# Altium project Mako DSP.PrjPCB (part 1 of 2)
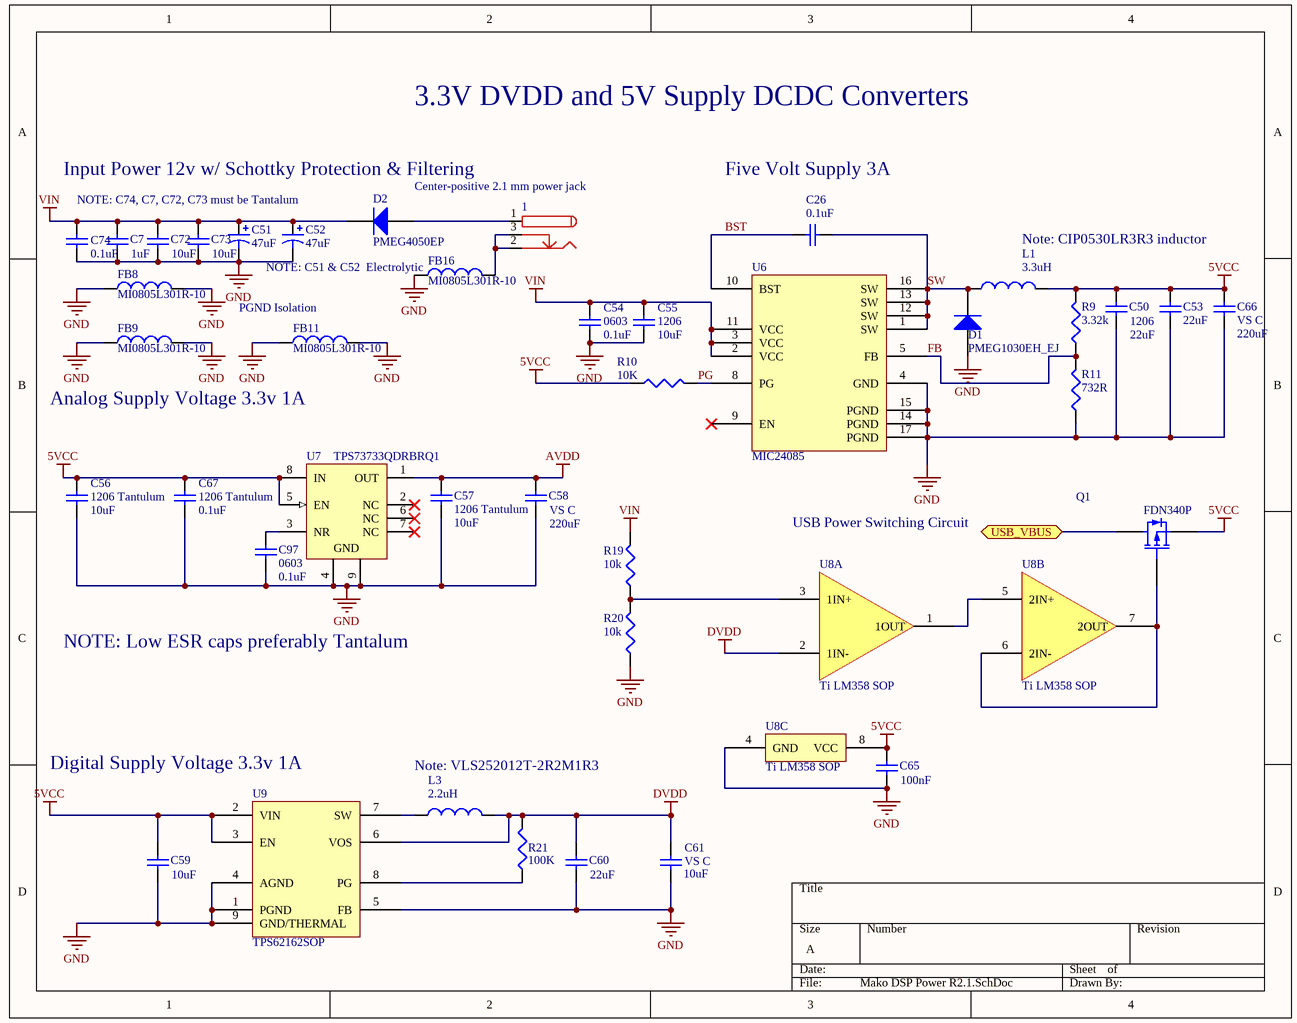
[diagram p0: Mako DSP Power R2.1.SchDoc]
8 sheets, 224 parts. Net scope: flat (ports and power ports of the same name join across sheets).
Board file: Mako DSP R2.0.PcbDoc
Sheets:
  Mako DSP Power R2.1.SchDoc
  Mako DSP Audio Codec R2.1.SchDoc
  Mako DSP Main R2.1.SchDoc
  Mako DSP Arduio IO R2.1.SchDoc
  Mako DSP USB R2.1.SchDoc
  Mako DSP Memory R2.1.SchDoc
  Mako DSP QuadFlash and Boot R2.1.SchDoc
  Mako DSP SD Card and MIDI R2.1.SchDoc

## Sheet Mako DSP Power R2.1.SchDoc
size A

### Parts
1  Center-positive 2.1 mm power jack  [PJ-102AH]
C7  value 1uF  [C1206]  (hidden comment: Cap Semi)
C26  value 0.1uF  [1608[0603]]  (hidden comment: Cap Semi)
C50  1206  value 22uF  [C1206]
C51  value 47uF  [CAPPR2.5-6.3x5]  (hidden comment: Cap Pol1)
C52  value 47uF  [CAPPR2.5-6.3x5]  (hidden comment: Cap Pol1)
C53  value 22uF  [C1206]  (hidden comment: Cap Semi)
C54  0603  value 0.1uF  [1608[0603]]
C55  1206  value 10uF  [C1206]
C56  1206 Tantulum  value 10uF  [C1206]
C57  1206 Tantulum  value 10uF  [C1206]
C58  VS C  value 220uF  [Panasonic VS C]
C59  value 10uF  [C1206]  (hidden comment: Cap Semi)
C60  value 22uF  [C1206]  (hidden comment: Cap Semi)
C61  VS C  value 10uF  [Panasonic VS C]
C65  value 100nF  [1608[0603]]  (hidden comment: Cap Semi)
C66  VS C  value 220uF  [Panasonic VS C]
C67  1206 Tantulum  value 0.1uF  [C1206]
C72  value 10uF  [C1206]  (hidden comment: Cap Semi)
C73  value 10uF  [C1206]  (hidden comment: Cap Semi)
C74  value 0.1uF  [C1206]  (hidden comment: Cap Semi)
C97  0603  value 0.1uF  [1608[0603]]
D1  PMEG1030EH_EJ  [PMEG1030EH_EJ]
D2  PMEG4050EP  [PMEG4050EP]
FB8  MI0805L301R-10  [SM 0805 - gap trimmed]
FB9  MI0805L301R-10  [SM 0805 - gap trimmed]
FB11  MI0805L301R-10  [SM 0805 - gap trimmed]
FB16  MI0805L301R-10  [SM 0805 - gap trimmed]
L1  value 3.3uH  [CIP0530LR3R3]  (hidden comment: Inductor)
L3  value 2.2uH  [VLS252012T-2R2M1R3]  (hidden comment: Inductor)
Q1  FDN340P  [SOT23-3N]
R9  value 3.32k  [J1-0603]  (hidden comment: Res3)
R10  value 10K  [J1-0603]  (hidden comment: Res3)
R11  value 732R  [J1-0603]  (hidden comment: Res3)
R19  value 10k  [J1-0603]  (hidden comment: Res3)
R20  value 10k  [J1-0603]  (hidden comment: Res3)
R21  value 100K  [RESC2012L]  (hidden comment: Res3)
U6  MIC24085  [MIC24085-AYML]
U7  TPS73733QDRBRQ1  [TI-DRB8-1750X1500TP_V]
U8  Ti LM358 SOP  [LM358]  (parts A,B,C of 3)
U9  TPS62162SOP  [TPS62162SOP]

### Ports
USB_VBUS (bidir)

### Nets
5VCC: C50.2 C53.1 C56.1 C59.2 C65.1 C66.2 C67.2 L1.2 Q1.2(D) R9.2 R10.1 U7.5(EN) U7.8(IN) U8.8(VCC) U9.2(VIN) U9.3(EN)
AVDD: C57.1 C58.1 U7.1(OUT)
DVDD: C60.2 C61.1 L3.2 R21.2 U8.2(1IN-) U9.6(VOS)
GND: C7.1 C50.1 C51.2 C52.2 C53.2 C54.1 C55.1 C56.2 C57.2 C58.2 C59.1 C60.1 C61.2 C65.2 C66.1 C67.1 C72.1 C73.1 C74.1 C97.1 D1.1(A) FB8.1 FB8.2 FB9.1 FB9.2 FB11.1 FB11.2 FB16.1 R11.1 R20.1 U6.4(GND) U6.14(PGND) U6.15(PGND) U6.17(PGND) U7.4(GND) U7.9(GND) U8.4(GND) U9.1(PGND) U9.4(AGND) U9.5(FB) U9.9(GND/THERMAL)
VIN: C7.2 C51.1 C52.1 C54.2 C55.2 C72.2 C73.2 C74.2 D2.1(A) R19.2 U6.2(VCC) U6.3(VCC) U6.11(VCC)
BST: C26.2 U6.10(BST)
FB: R9.1 R11.2 U6.5(FB)
PG: R10.2 U6.8(PG)
SW: C26.1 D1.2(K) L1.1 U6.1(SW) U6.12(SW) U6.13(SW) U6.16(SW)
Net1_1: 1.1 D2.2(K)
Net1_2: 1.2 1.3 FB16.2
NetC97_2: C97.2 U7.3(NR)
NetL3_1: L3.1 U9.7(SW)
NetQ1_1: Q1.1(G) U8.6(2IN-) U8.7(2OUT)
NetQ1_3: Q1.3(S) ; port USB_VBUS
NetR19_1: R19.1 R20.2 U8.3(1IN+)
NetR21_1: R21.1 U9.8(PG)
NetU8_1: U8.1(1OUT) U8.5(2IN+)

Not connected (* = marked no-connect by the designer): U6 6(NC) 7(NC) 9(EN)*; U7 2(NC)* 6(NC)* 7(NC)*

### Notes on the sheet
- 3.3V DVDD and 5V Supply DCDC Converters
- Input Power 12v w/ Schottky Protection & Filtering
- NOTE: C74, C7, C72, C73 must be Tantalum
- Five Volt Supply 3A
- (near FB16) NOTE: C51 & C52  Electrolytic
- Note: CIP0530LR3R3 inductor
- (near FB11) PGND Isolation
- Analog Supply Voltage 3.3v 1A
- USB Power Switching Circuit
- NOTE: Low ESR caps preferably Tantalum
- (near U9) Digital Supply Voltage 3.3v 1A
- Note: VLS252012T-2R2M1R3

### Library data of the parts
1 = PWR2.5: Power jack; Published: 17-Dec-2003; DatasheetDocument: 09-May-2002; Publisher: Altium Limited; ComponentLink1Description: Manufacturer Link; ComponentLink1URL: http://domino.kycon.com/internet/Products.html
C7 C26 C50 C53-C61 C65-C67 C72-C74 C97 = Cap Semi: Capacitor (Semiconductor SIM Model); Published: 8-Jun-2000; LatestRevisionDate: 29-May-2009; LatestRevisionNote: IPC-7351 Footprint Added.; PackageReference: C1206; Publisher: Altium Limited; PackageDescription: Chip Capacitor
C51 C52 = Cap Pol1: Polarized Capacitor (Radial); Published: 8-Jun-2000; LatestRevisionDate: 17-Jul-2002; LatestRevisionNote: Re-released for DXP Platform.; PackageReference: RB7.6-15; Publisher: Altium Limited; PackageDescription: Polarized Capacitor (Radial); 2 Leads
D1 D2 = Diode: Default Diode; Published: 8-Jun-2000; LatestRevisionDate: 17-Jul-2002; LatestRevisionNote: Re-released for DXP Platform.; PackageVersion: Sep-1996; PackageReference: SMC; Publisher: Altium Limited; PackageDescription: DO-214-AB/SMC; 2 C-Bend Leads; Body 7.9 x 5.9 mm, inc. leads (LxW); Code_JEDEC: DO-214-AB
FB8 FB9 FB11 FB16 L1 L3 = Inductor: Code_IEC: 1005; Published: 8-Jun-2000; PackageReference: 0402-A; Publisher: Altium Limited; Code_JEITA: 0402
  FB8 FB9 FB11 FB16: LatestRevisionDate: 17-Jul-2002; LatestRevisionNote: Re-released for DXP Platform.
  L1 L3: LatestRevisionDate: 29-May-2009; LatestRevisionNote: IPC-7351 Footprint Added.; PackageDescription: Chip Inductor
Q1 = FDN340P: P-Channel MOSFET; Published: 8-Jun-2000; LatestRevisionDate: 17-Jul-2002; LatestRevisionNote: Re-released for DXP Platform.; PackageVersion: 1995/1996; PackageReference: E3; Publisher: Altium Limited; PackageDescription: TO, Flat Index; 3 In-Line, Axial Leads; Body Dia. 4.6mm; Lead Dia. 0.5 mm (max)
R9-R11 R19-R21 = Res3: Resistor; Published: 8-Jun-2000; LatestRevisionDate: 29-May-2009; LatestRevisionNote: IPC-7351 Footprint Added.; PackageReference: J1-0603; Publisher: Altium Limited; PackageDescription: Chip Resistor
U7 = TPS73733QDRBRQ1: Single Output Automotive LDO, 1 A, Fixed 3.3 V Output, 2.2 to 5.5 V Input, with Reverse Current Protection, 8-pin SON (DRB), -40 to 125 degC, Green (RoHS & no Sb/Br); Manufacturer: Texas Instruments; Accuracy(%): 3; Fixed Output Options(V): 3.3; Iout(Max)(A): 1; Iq(Typ)(mA): 0.3; SubFamily: Single Channel LDO; Vdo(Typ)(mV): 130; Vin(Max)(V): 5.5; Vin(Min)(V): 2.2; DatasheetVersion: SBVS123; PackageVersion: 4203482-2/K; PackageReference: DRB8-1750X1500TP; PackageDescription: 8-Pin Plastic Small Outline, Body 3 x 3 mm, Pitch 0.65 mm; Supplier 1: Digi-Key; Supplier Part Number 1: 296-24157-2-ND; Supplier 2: Digi-Key; Supplier Part Number 2: 296-24157-1-ND; Supplier 3: Digi-Key; Supplier Part Number 3: 296-24157-6-ND; Supplier 4: Newark; Supplier Part Number 4: 56P3118; Supplier 5: Mouser; Supplier Part Number 5: 595-TPS73733QDRBRQ1; Eco-Plan: Green (RoHS & no Sb/Br); Rating: Automotive; Vout Adj(Max)(V): 3.3; Vout Adj(Min)(V): 3.3; Mounting Technology: Surface Mount; PartNumber: TPS73733QDRBRQ1; ComponentLink1Description: Manufacturer URL; ComponentLink1URL: http://www.ti.com/; ComponentLink2Description: Datasheet; ComponentLink2URL: http://www.ti.com/general/docs/lit/getliterature.tsp?genericPartNumber=TPS73733-Q1&fileType=pdf; ComponentLink3Description: Package Specification; ComponentLink3URL: http://www.ti.com/litv/pdf/mpds118h
U8 = LM358_Symbol

## Sheet Mako DSP Audio Codec R2.1.SchDoc
size B
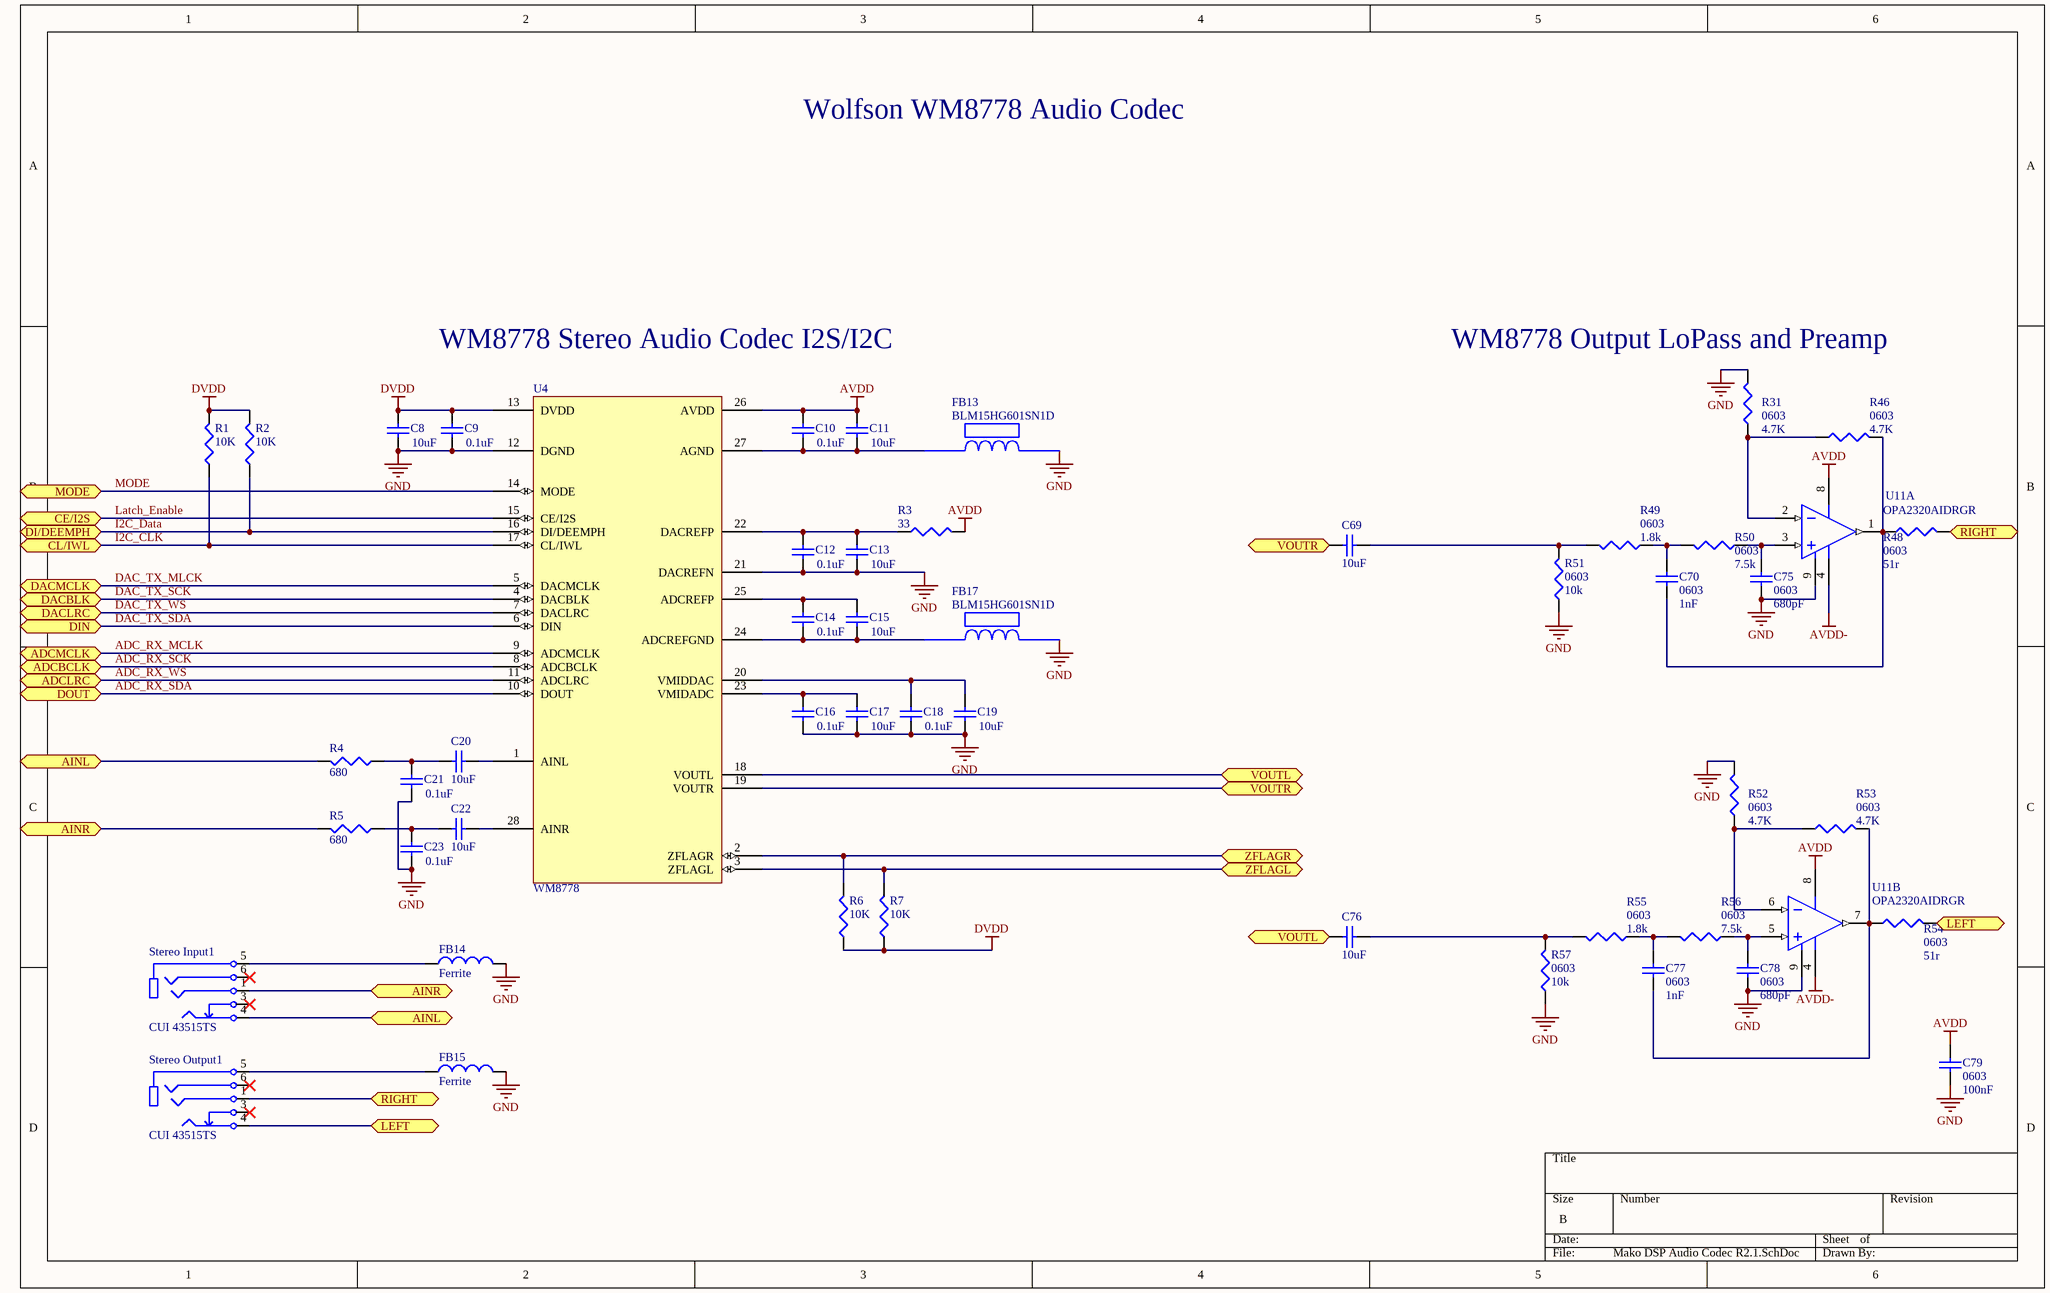
[diagram p1: Mako DSP Audio Codec R2.1.SchDoc]

### Parts
C8  value 10uF  [1608[0603]]  (hidden comment: Cap Semi)
C9  value 0.1uF  [1608[0603]]  (hidden comment: Cap Semi)
C10  value 0.1uF  [1608[0603]]  (hidden comment: Cap Semi)
C11  value 10uF  [1608[0603]]  (hidden comment: Cap Semi)
C12  value 0.1uF  [1608[0603]]  (hidden comment: Cap Semi)
C13  value 10uF  [1608[0603]]  (hidden comment: Cap Semi)
C14  value 0.1uF  [1608[0603]]  (hidden comment: Cap Semi)
C15  value 10uF  [1608[0603]]  (hidden comment: Cap Semi)
C16  value 0.1uF  [1608[0603]]  (hidden comment: Cap Semi)
C17  value 10uF  [1608[0603]]  (hidden comment: Cap Semi)
C18  value 0.1uF  [1608[0603]]  (hidden comment: Cap Semi)
C19  value 10uF  [1608[0603]]  (hidden comment: Cap Semi)
C20  value 10uF  [Panasonic VS B]  (hidden comment: Cap Semi)
C21  value 0.1uF  [SM 0805 - gap trimmed]  (hidden comment: Cap Semi)
C22  value 10uF  [Panasonic VS B]  (hidden comment: Cap Semi)
C23  value 0.1uF  [SM 0805 - gap trimmed]  (hidden comment: Cap Semi)
C69  value 10uF  [Panasonic VS B]  (hidden comment: Cap Semi)
C70  0603  value 1nF  [1608[0603]]
C75  0603  value 680pF  [1608[0603]]
C76  value 10uF  [Panasonic VS B]  (hidden comment: Cap Semi)
C77  0603  value 1nF  [1608[0603]]
C78  0603  value 680pF  [1608[0603]]
C79  0603  value 100nF  [1608[0603]]
FB13  BLM15HG601SN1D  [BLM18PG121SN1D]
FB14  Ferrite  [SM 0805 - gap trimmed]
FB15  Ferrite  [SM 0805 - gap trimmed]
FB17  BLM15HG601SN1D  [BLM18PG121SN1D]
R1  value 10K  [J1-0603]  (hidden comment: Res3)
R2  value 10K  [J1-0603]  (hidden comment: Res3)
R3  value 33  [J1-0603]  (hidden comment: Res3)
R4  value 680  [SM 0805 - gap trimmed]  (hidden comment: Res3)
R5  value 680  [SM 0805 - gap trimmed]  (hidden comment: Res3)
R6  value 10K  [J1-0603]  (hidden comment: Res3)
R7  value 10K  [J1-0603]  (hidden comment: Res3)
R31  0603  value 4.7K  [J1-0603]
R46  0603  value 4.7K  [J1-0603]
R48  0603  value 51r  [J1-0603]
R49  0603  value 1.8k  [J1-0603]
R50  0603  value 7.5k  [J1-0603]
R51  0603  value 10k  [J1-0603]
R52  0603  value 4.7K  [J1-0603]
R53  0603  value 4.7K  [J1-0603]
R54  0603  value 51r  [J1-0603]
R55  0603  value 1.8k  [J1-0603]
R56  0603  value 7.5k  [J1-0603]
R57  0603  value 10k  [J1-0603]
Stereo_Input1  CUI 43515TS  [CUI SJ-43515TS]
Stereo_Output1  CUI 43515TS  [CUI SJ-43515TS]
U4  WM8778  [WM8778]
U11  OPA2320AIDRGR  [TI-DRG8-2000X1200TP_V]  (parts A,B of 2)

### Ports
ADCBCLK (bidir), ADCLRC (bidir), ADCMCLK (bidir), AINL, AINR, CE/I2S (bidir), CL/IWL (bidir), DACBLK (bidir), DACLRC (bidir), DACMCLK (bidir), DI/DEEMPH (bidir), DIN (bidir), DOUT (bidir), LEFT, MODE (bidir), RIGHT, VOUTL, VOUTR, ZFLAGL (bidir), ZFLAGR (bidir)

### Nets
AVDD: C10.2 C11.2 C79.2 R3.2 U4.26(AVDD) U11.8(V+)
AVDD-: U11.4(V-)
DVDD: C8.2 C9.2 R1.2 R2.2 R6.1 R7.1 U4.13(DVDD)
GND: C8.1 C9.1 C12.1 C13.1 C16.1 C17.1 C18.1 C19.1 C21.1 C23.1 C75.1 C78.1 C79.1 FB13.2 FB14.2 FB15.2 FB17.2 R31.2 R51.1 R52.2 R57.1 U4.12(DGND) U4.21(DACREFN) U11.9(EP)
ADC_RX_MCLK: U4.9(ADCMCLK) ; port ADCMCLK
ADC_RX_SCK: U4.8(ADCBCLK) ; port ADCBCLK
ADC_RX_SDA: U4.10(DOUT) ; port DOUT
ADC_RX_WS: U4.11(ADCLRC) ; port ADCLRC
DAC_TX_MLCK: U4.5(DACMCLK) ; port DACMCLK
DAC_TX_SCK: U4.4(DACBLK) ; port DACBLK
DAC_TX_SDA: U4.6(DIN) ; port DIN
DAC_TX_WS: U4.7(DACLRC) ; port DACLRC
I2C_CLK: R1.1 U4.17(CL/IWL) ; port CL/IWL
I2C_Data: R2.1 U4.16(DI/DEEMPH) ; port DI/DEEMPH
Latch_Enable: U4.15(CE/I2S) ; port CE/I2S
MODE: U4.14(MODE) ; port MODE
NetC10_1: C10.1 C11.1 FB13.1 U4.27(AGND)
NetC12_2: C12.2 C13.2 R3.1 U4.22(DACREFP)
NetC14_1: C14.1 C15.1 FB17.1 U4.24(ADCREFGND)
NetC14_2: C14.2 C15.2 U4.25(ADCREFP)
NetC16_2: C16.2 C17.2 U4.23(VMIDADC)
NetC18_2: C18.2 C19.2 U4.20(VMIDDAC)
NetC20_1: C20.1 U4.1(AINL)
NetC20_2: C20.2 C21.2 R4.1
NetC22_1: C22.1 U4.28(AINR)
NetC22_2: C22.2 C23.2 R5.1
NetC69_1: C69.1 U4.19(VOUTR) ; port VOUTR
NetC69_2: C69.2 R49.2 R51.2
NetC70_1: C70.1 R46.2 R48.1 U11.1(OUT_A)
NetC70_2: C70.2 R49.1 R50.2
NetC75_2: C75.2 R50.1 U11.3(IN_A+)
NetC76_1: C76.1 U4.18(VOUTL) ; port VOUTL
NetC76_2: C76.2 R55.2 R57.2
NetC77_1: C77.1 R53.2 R54.1 U11.7(OUT_B)
NetC77_2: C77.2 R55.1 R56.2
NetC78_2: C78.2 R56.1 U11.5(IN_B+)
NetFB14_1: FB14.1 Stereo_Input1.5(SLEEVE)
NetFB15_1: FB15.1 Stereo_Output1.5(SLEEVE)
NetR4_2: R4.2 Stereo_Input1.4(TIP) ; port AINL
NetR5_2: R5.2 Stereo_Input1.1(R1) ; port AINR
NetR6_2: R6.2 U4.2(ZFLAGR) ; port ZFLAGR
NetR7_2: R7.2 U4.3(ZFLAGL) ; port ZFLAGL
NetR31_1: R31.1 R46.1 U11.2(IN_A-)
NetR48_2: R48.2 Stereo_Output1.1(R1) ; port RIGHT
NetR52_1: R52.1 R53.1 U11.6(IN_B-)
NetR54_2: R54.2 Stereo_Output1.4(TIP) ; port LEFT

Not connected (* = marked no-connect by the designer): Stereo_Input1 3(TS)* 6(R2)*; Stereo_Output1 3(TS)* 6(R2)*

### Notes on the sheet
- Wolfson WM8778 Audio Codec
- WM8778 Stereo Audio Codec I2S/I2C
- (near R31) WM8778 Output LoPass and Preamp

### Library data of the parts
C8-C23 C69 C70 C75-C79 = Cap Semi: Capacitor (Semiconductor SIM Model); Published: 8-Jun-2000; LatestRevisionDate: 29-May-2009; LatestRevisionNote: IPC-7351 Footprint Added.; PackageReference: C1206; Publisher: Altium Limited; PackageDescription: Chip Capacitor
FB14 FB15 = Inductor: Code_IEC: 1005; Published: 8-Jun-2000; LatestRevisionDate: 17-Jul-2002; LatestRevisionNote: Re-released for DXP Platform.; PackageReference: 0402-A; Publisher: Altium Limited; Code_JEITA: 0402
R1-R7 R31 R46 R48-R57 = Res3: Resistor; Published: 8-Jun-2000; LatestRevisionDate: 29-May-2009; LatestRevisionNote: IPC-7351 Footprint Added.; PackageReference: J1-0603; Publisher: Altium Limited; PackageDescription: Chip Resistor
U11 = OPA2320AIDRGR: Precision, 20 MHz, 0.9 pA Ib, RRIO, CMOS Operational Amplifier, 1.8 to 5.5 V, -40 to 125 degC, 8-pin SON (DRG8), Green (RoHS & no Sb/Br); Manufacturer: Texas Instruments; CMRR(Min)(dB): 100; IIB(Max)(pA): 400; Iq per channel(Max)(mA): 1.6; Number of Channels: 2; Offset Drift(Typ)(uV/C): 1.5; Slew Rate(Typ)(V/us): 10; Sub Family: High Output Current Amplifier (>=50mA), Low Input Bias Current Amp (<=10pA), Low Noise Amp (<=10nV/rtHz), Low Offset Voltage Amplifier (<=500uV), Low Supply Voltage Amplifier (<=2.7V), Precision Amplifier; Total Supply Voltage(Max)(+5V is 5, +/-5V is 10): 5.5; Total Supply Voltage(Min)(+5V is 5, +/-5V is 10): 1.8; Vio (25C)(Max)(mV): 0.15; Vn at 1kHz(Typ)(nV/rtHz): 8.5; DatasheetVersion: SBOS513D; PackageVersion: 4205379/C, 12/2010; PackageReference: DRG8-2000X1200TP; PackageDescription: 8-Pin Plastic Small Outline, Body 3 x 3 mm, Pitch 0.5 mm; Supplier 1: Digi-Key; Supplier Part Number 1: OPA2320AIDRGR-ND; Supplier 2: Mouser; Supplier Part Number 2: 595-OPA2320AIDRGR; Eco-Plan: Green (RoHS & no Sb/Br); Mounting Technology: Surface Mount; Code_JEDEC: MO-229; PartNumber: OPA2320AIDRGR; ComponentLink1Description: Manufacturer URL; ComponentLink1URL: http://www.ti.com/; ComponentLink2Description: Datasheet; ComponentLink2URL: http://www.ti.com/general/docs/lit/getliterature.tsp?genericPartNumber=OPA2320&fileType=pdf; ComponentLink3Description: Package Specification; ComponentLink3URL: http://www.ti.com/litv/pdf/mpds151b

## Sheet Mako DSP Main R2.1.SchDoc
size C
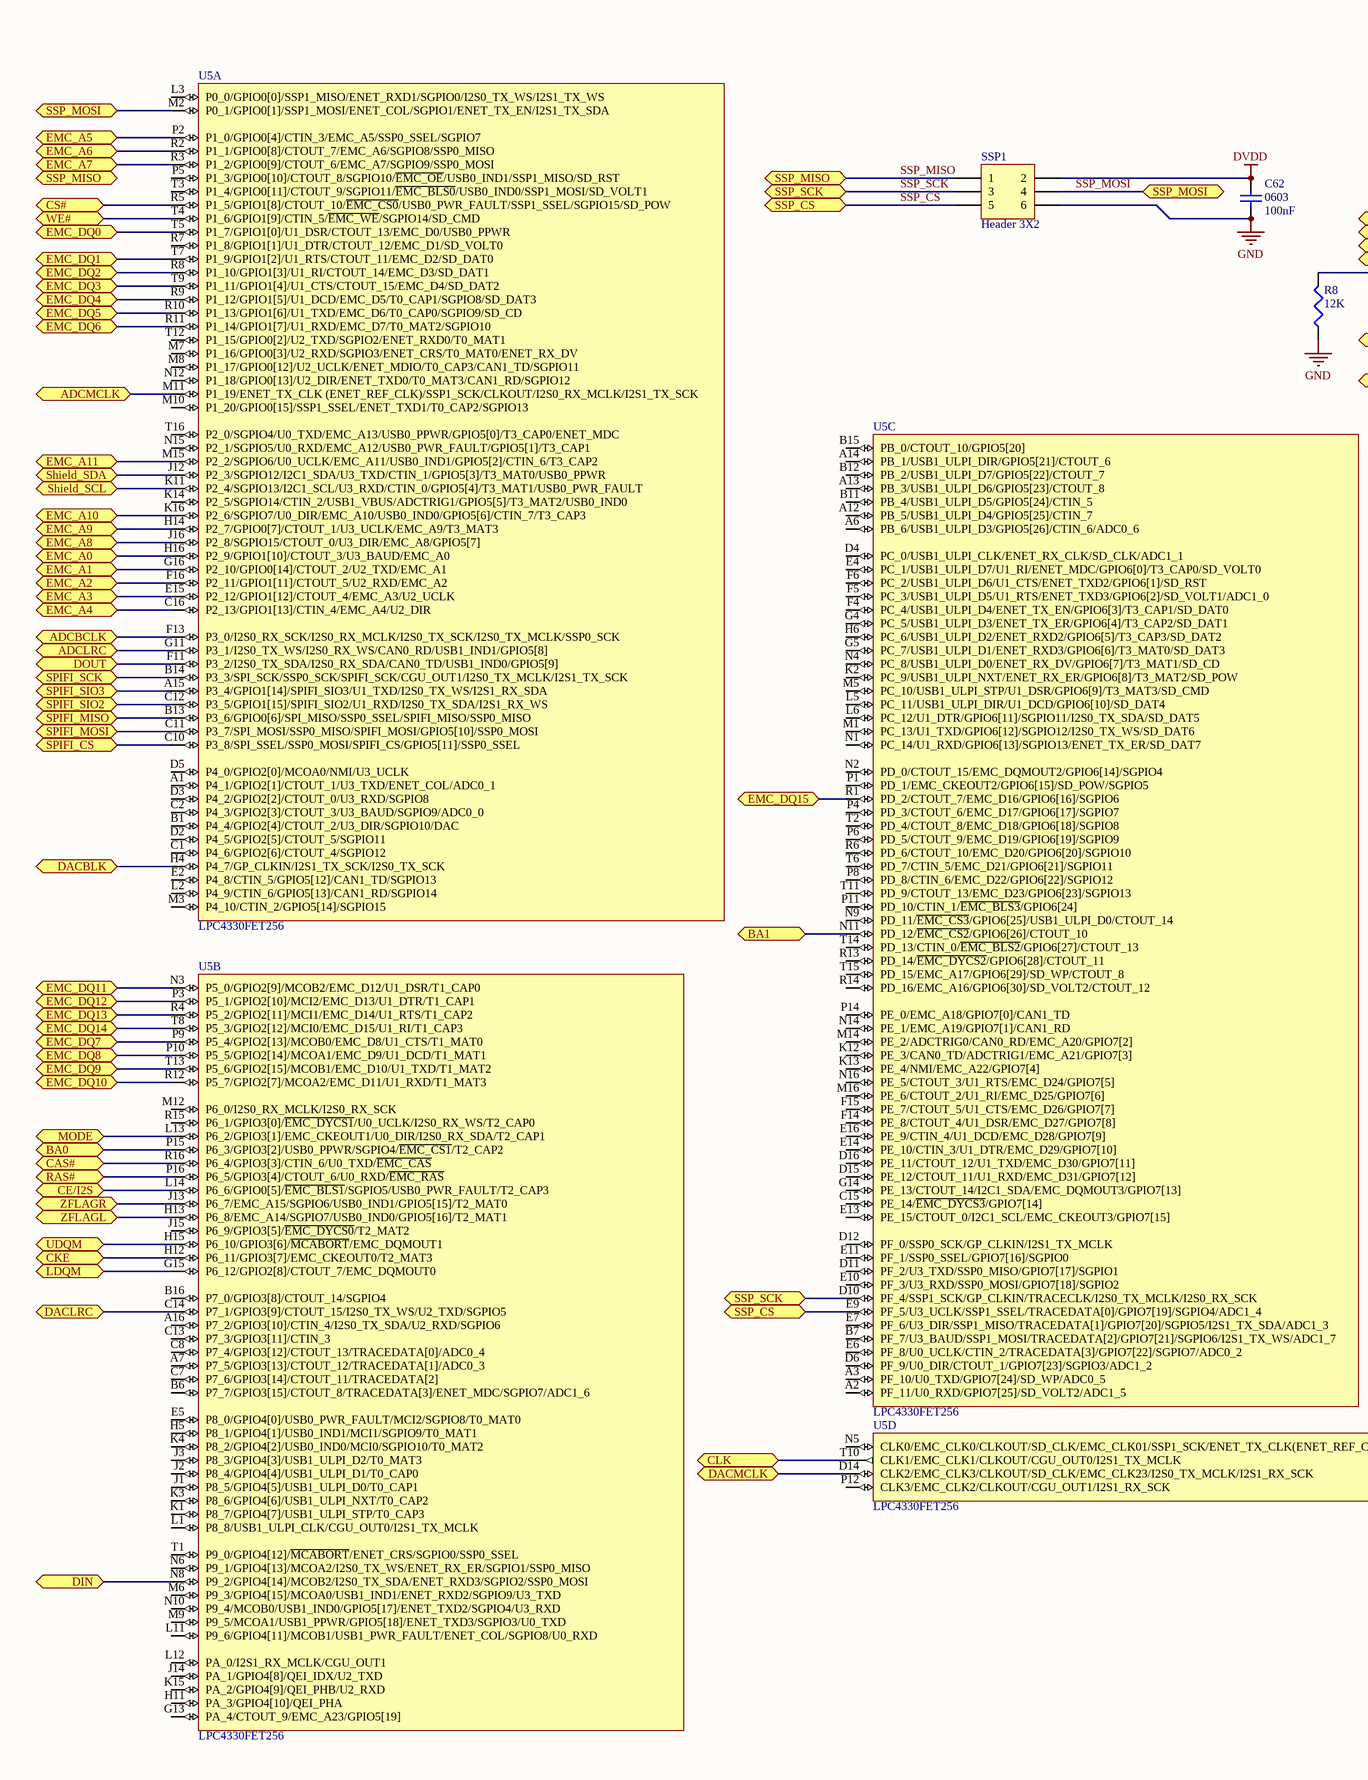
[diagram p2: Mako DSP Main R2.1.SchDoc, left]
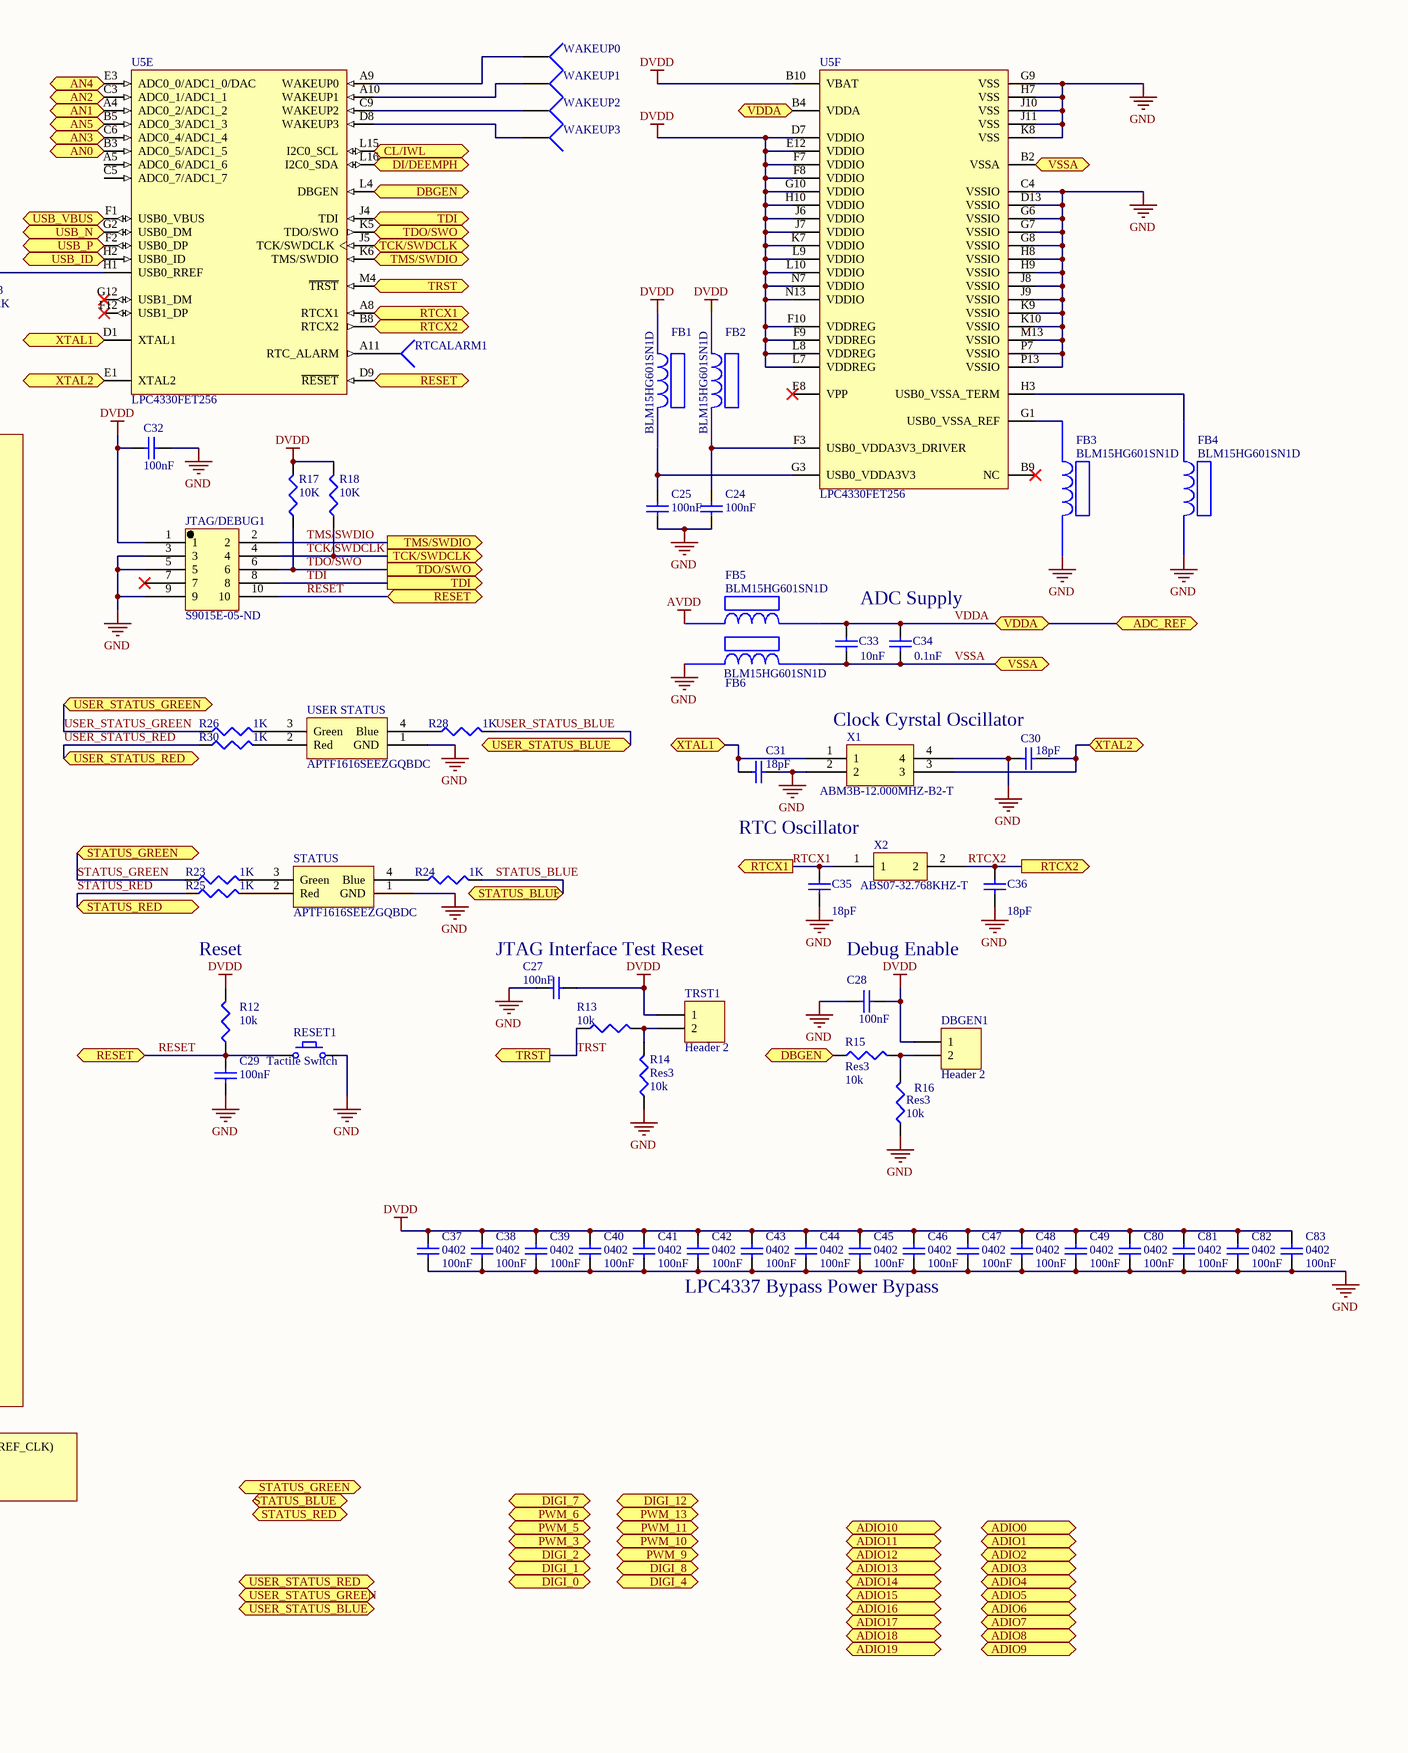
[diagram p3: Mako DSP Main R2.1.SchDoc, right]

### Parts
C24  value 100nF  [0402]  (hidden comment: Cap Semi)
C25  value 100nF  [0402]  (hidden comment: Cap Semi)
C27  C1: 100nF  [CAPC1608L]  (hidden comment: Cap Semi)
C28  C1: 100nF  [CAPC1608L]  (hidden comment: Cap Semi)
C29  C1: 100nF  [CAPC1608L]  (hidden comment: Cap Semi)
C30  value 18pF  [1608[0603]]  (hidden comment: Cap Semi)
C31  value 18pF  [1608[0603]]  (hidden comment: Cap Semi)
C32  C1: 100nF  [CAPC1608L]  (hidden comment: Cap Semi)
C33  value 10nF  [1608[0603]]  (hidden comment: Cap Semi)
C34  value 0.1nF  [1608[0603]]  (hidden comment: Cap Semi)
C35  value 18pF  [1608[0603]]  (hidden comment: Cap Semi)
C36  value 18pF  [1608[0603]]  (hidden comment: Cap Semi)
C37  0402  value 100nF  [0402]
C38  0402  value 100nF  [0402]
C39  0402  value 100nF  [0402]
C40  0402  value 100nF  [0402]
C41  0402  value 100nF  [0402]
C42  0402  value 100nF  [0402]
C43  0402  value 100nF  [0402]
C44  0402  value 100nF  [0402]
C45  0402  value 100nF  [0402]
C46  0402  value 100nF  [0402]
C47  0402  value 100nF  [0402]
C48  0402  value 100nF  [0402]
C49  0402  value 100nF  [0402]
C62  0603  value 100nF  [1608[0603]]
C80  0402  value 100nF  [0402]
C81  0402  value 100nF  [0402]
C82  0402  value 100nF  [0402]
C83  0402  value 100nF  [0402]
DBGEN1  Header 2  [HDR1X2]
FB1  BLM15HG601SN1D  [BLM18PG121SN1D]
FB2  BLM15HG601SN1D  [BLM18PG121SN1D]
FB3  BLM15HG601SN1D  [BLM18PG121SN1D]
FB4  BLM15HG601SN1D  [BLM18PG121SN1D]
FB5  BLM15HG601SN1D  [BLM18PG121SN1D]
FB6  BLM15HG601SN1D  [BLM18PG121SN1D]
JTAG/DEBUG1  S9015E-05-ND  [S9015E-05-ND]
R8  value 12K  [J1-0603]  (hidden comment: Res3)
R12  value 10k  [J1-0603]  (hidden comment: Res3)
R13  value 10k  [J1-0603]  (hidden comment: Res3)
R14  Res3  value 10k  [J1-0603]
R15  Res3  value 10k  [J1-0603]
R16  Res3  value 10k  [J1-0603]
R17  value 10K  [J1-0603]  (hidden comment: Res3)
R18  value 10K  [J1-0603]  (hidden comment: Res3)
R23  value 1K  [J1-0603]  (hidden comment: Res3)
R24  value 1K  [J1-0603]  (hidden comment: Res3)
R25  value 1K  [J1-0603]  (hidden comment: Res3)
R26  value 1K  [J1-0603]  (hidden comment: Res3)
R28  value 1K  [J1-0603]  (hidden comment: Res3)
R30  value 1K  [J1-0603]  (hidden comment: Res3)
RESET1  Tactile Switch  [TL3301]
RTCALARM1  Socket  [PIN1]  (value not drawn)
SSP1  Header 3X2  [HDR2X3]
STATUS  APTF1616SEEZGQBDC  [RGB LED APTF1616SEEZGQBDC]
TRST1  Header 2  [HDR1X2]
U5  LPC4330FET256  [SOT740-2]  (parts A,B,C,D,E,F of 6)
USER_STATUS  APTF1616SEEZGQBDC  [RGB LED APTF1616SEEZGQBDC]
WAKEUP0  Socket  [PIN1]  (value not drawn)
WAKEUP1  Socket  [PIN1]  (value not drawn)
WAKEUP2  Socket  [PIN1]  (value not drawn)
WAKEUP3  Socket  [PIN1]  (value not drawn)
X1  ABM3B-12.000MHZ-B2-T  [ABM3B-12.000MHZ-B2-T]
X2  ABS07-32.768KHZ-T  [ABS07-32.768KHZ-T]

### Ports
ADC_REF, ADCBCLK (bidir), ADCLRC (bidir), ADCMCLK (bidir), ADIO0 (bidir), ADIO1 (bidir), ADIO2 (bidir), ADIO3 (bidir), ADIO4, ADIO5 (bidir), ADIO6 (bidir), ADIO7, ADIO8 (bidir), ADIO9, ADIO10 (bidir), ADIO11 (bidir), ADIO12 (bidir), ADIO13 (bidir), ADIO14 (bidir), ADIO15 (bidir), ADIO16 (bidir), ADIO17 (bidir), ADIO18 (bidir), ADIO19 (bidir), AN0 (bidir), AN1 (bidir), AN2 (bidir), AN3 (bidir), AN4 (bidir), AN5 (bidir), BA0, BA1, CAS#, CE/I2S (bidir), CKE, CL/IWL (bidir), CLK, CS#, DACBLK (bidir), DACLRC (bidir), DACMCLK (bidir), DBGEN (in), DBGEN (out), DI/DEEMPH (bidir), DIGI_0 (bidir), DIGI_1 (bidir), DIGI_2 (bidir), DIGI_4 (bidir), DIGI_7 (bidir), DIGI_8 (bidir), DIGI_12 (bidir), DIN (bidir), DOUT (bidir), EMC_A0, EMC_A1, EMC_A2, EMC_A3, EMC_A4, EMC_A5, EMC_A6, EMC_A7, EMC_A8, EMC_A9, EMC_A10, EMC_A11, EMC_DQ0, EMC_DQ1, EMC_DQ2, EMC_DQ3, EMC_DQ4, EMC_DQ5, EMC_DQ6, EMC_DQ7, EMC_DQ8, EMC_DQ9, EMC_DQ10, EMC_DQ11, EMC_DQ12, EMC_DQ13, EMC_DQ14, EMC_DQ15, LDQM, MODE (bidir), PWM_3 (bidir), PWM_5 (bidir), PWM_6 (bidir), PWM_9 (bidir), PWM_10 (bidir), PWM_11 (bidir), PWM_13 (bidir), RAS#, RESET (bidir), RTCX1 (in), RTCX1 (out), RTCX2 (out), Shield_SCL (bidir), Shield_SDA (bidir), SPIFI_CS, SPIFI_MISO, SPIFI_MOSI, SPIFI_SCK, SPIFI_SIO2, SPIFI_SIO3, SSP_CS, SSP_MISO, SSP_MOSI, SSP_SCK, STATUS_BLUE (bidir), STATUS_GREEN (bidir), STATUS_RED (bidir), TCK/SWDCLK (in), TCK/SWDCLK (out), TDI (in), TDI (out), TDO/SWO (out), TMS/SWDIO (in), TMS/SWDIO (out), TRST (in), TRST (out), UDQM, USB_ID (bidir), USB_N (bidir), USB_P (bidir), USB_VBUS (bidir), USER_STATUS_BLUE (bidir), USER_STATUS_GREEN (bidir), USER_STATUS_RED (bidir), VDDA, VSSA, WE#, XTAL1 (bidir), XTAL2 (bidir), ZFLAGL (bidir), ZFLAGR (bidir)

### Nets
AVDD: FB5.1
DVDD: C27.2 C28.2 C32.1 C37.2 C38.2 C39.2 C40.2 C41.2 C42.2 C43.2 C44.2 C45.2 C46.2 C47.2 C48.2 C49.2 C62.2 C80.2 C81.2 C82.2 C83.2 DBGEN1.1 FB1.1 FB2.1 JTAG/DEBUG1.1 R12.2 R17.2 R18.2 SSP1.2 TRST1.1 U5.B10(VBAT) U5.D7(VDDIO) U5.E12(VDDIO) U5.F7(VDDIO) U5.F8(VDDIO) U5.F9(VDDREG) U5.F10(VDDREG) U5.G10(VDDIO) U5.H10(VDDIO) U5.J6(VDDIO) U5.J7(VDDIO) U5.K7(VDDIO) U5.L7(VDDREG) U5.L8(VDDREG) U5.L9(VDDIO) U5.L10(VDDIO) U5.N7(VDDIO) U5.N13(VDDIO)
GND: C24.1 C25.1 C27.1 C28.1 C29.1 C30.2 C31.1 C32.2 C35.1 C36.1 C37.1 C38.1 C39.1 C40.1 C41.1 C42.1 C43.1 C44.1 C45.1 C46.1 C47.1 C48.1 C49.1 C62.1 C80.1 C81.1 C82.1 C83.1 FB3.2 FB4.2 FB6.1 JTAG/DEBUG1.3 JTAG/DEBUG1.5 JTAG/DEBUG1.9 R8.1 R14.1 R16.1 RESET1.2 SSP1.6 STATUS.1(GND) U5.C4(VSSIO) U5.D13(VSSIO) U5.G6(VSSIO) U5.G7(VSSIO) U5.G8(VSSIO) U5.G9(VSS) U5.H7(VSS) U5.H8(VSSIO) U5.H9(VSSIO) U5.J8(VSSIO) U5.J9(VSSIO) U5.J10(VSS) U5.J11(VSS) U5.K8(VSS) U5.K9(VSSIO) U5.K10(VSSIO) U5.M13(VSSIO) U5.P7(VSSIO) U5.P13(VSSIO) USER_STATUS.1(GND) X1.2 X1.4
ADC_RX_MCLK: U5.M11(P1_19/ENET_TX_CLK_(ENET_REF_CLK)/SSP1_SCK/CLKOUT/I2S0_RX_MCLK/I2S1_TX_SCK) ; port ADCMCLK
ADC_RX_SCK: U5.F13(P3_0/I2S0_RX_SCK/I2S0_RX_MCLK/I2S0_TX_SCK/I2S0_TX_MCLK/SSP0_SCK) ; port ADCBCLK
ADC_RX_SDA: U5.F11(P3_2/I2S0_TX_SDA/I2S0_RX_SDA/CAN0_TD/USB1_IND0/GPIO5[9]) ; port DOUT
ADC_RX_WS: U5.G11(P3_1/I2S0_TX_WS/I2S0_RX_WS/CAN0_RD/USB1_IND1/GPIO5[8]) ; port ADCLRC
BA0: U5.P15(P6_3/GPIO3[2]/USB0_PPWR/SGPIO4/~{EMC_CS1}/T2_CAP2) ; port BA0
BA1: U5.N11(PD_12/~{EMC_CS2}/GPIO6[26]/CTOUT_10) ; port BA1
CAS#: U5.R16(P6_4/GPIO3[3]/CTIN_6/U0_TXD/~{EMC_CAS}) ; port CAS#
CKE: U5.H12(P6_11/GPIO3[7]/EMC_CKEOUT0/T2_MAT3) ; port CKE
CLK: U5.T10(CLK1/EMC_CLK1/CLKOUT/CGU_OUT0/I2S1_TX_MCLK) ; port CLK
CS#: U5.R5(P1_5/GPIO1[8]/CTOUT_10/~{EMC_CS0}/USB0_PWR_FAULT/SSP1_SSEL/SGPIO15/SD_POW) ; port CS#
DAC_TX_MLCK: U5.D14(CLK2/EMC_CLK3/CLKOUT/SD_CLK/EMC_CLK23/I2S0_TX_MCLK/I2S1_RX_SCK) ; port DACMCLK
DAC_TX_SCK: U5.H4(P4_7/GP_CLKIN/I2S1_TX_SCK/I2S0_TX_SCK) ; port DACBLK
DAC_TX_SDA: U5.N8(P9_2/GPIO4[14]/MCOB2/I2S0_TX_SDA/ENET_RXD3/SGPIO2/SSP0_MOSI) ; port DIN
DAC_TX_WS: U5.C14(P7_1/GPIO3[9]/CTOUT_15/I2S0_TX_WS/U2_TXD/SGPIO5) ; port DACLRC
EMC_A0: U5.H16(P2_9/GPIO1[10]/CTOUT_3/U3_BAUD/EMC_A0) ; port EMC_A0
EMC_A1: U5.G16(P2_10/GPIO0[14]/CTOUT_2/U2_TXD/EMC_A1) ; port EMC_A1
EMC_A2: U5.F16(P2_11/GPIO1[11]/CTOUT_5/U2_RXD/EMC_A2) ; port EMC_A2
EMC_A3: U5.E15(P2_12/GPIO1[12]/CTOUT_4/EMC_A3/U2_UCLK) ; port EMC_A3
EMC_A4: U5.C16(P2_13/GPIO1[13]/CTIN_4/EMC_A4/U2_DIR) ; port EMC_A4
EMC_A5: U5.P2(P1_0/GPIO0[4]/CTIN_3/EMC_A5/SSP0_SSEL/SGPIO7) ; port EMC_A5
EMC_A6: U5.R2(P1_1/GPIO0[8]/CTOUT_7/EMC_A6/SGPIO8/SSP0_MISO) ; port EMC_A6
EMC_A7: U5.R3(P1_2/GPIO0[9]/CTOUT_6/EMC_A7/SGPIO9/SSP0_MOSI) ; port EMC_A7
EMC_A8: U5.J16(P2_8/SGPIO15/CTOUT_0/U3_DIR/EMC_A8/GPIO5[7]) ; port EMC_A8
EMC_A9: U5.H14(P2_7/GPIO0[7]/CTOUT_1/U3_UCLK/EMC_A9/T3_MAT3) ; port EMC_A9
EMC_A10: U5.K16(P2_6/SGPIO7/U0_DIR/EMC_A10/USB0_IND0/GPIO5[6]/CTIN_7/T3_CAP3) ; port EMC_A10
EMC_A11: U5.M15(P2_2/SGPIO6/U0_UCLK/EMC_A11/USB0_IND1/GPIO5[2]/CTIN_6/T3_CAP2) ; port EMC_A11
EMC_DQ0: U5.T5(P1_7/GPIO1[0]/U1_DSR/CTOUT_13/EMC_D0/USB0_PPWR) ; port EMC_DQ0
EMC_DQ1: U5.T7(P1_9/GPIO1[2]/U1_RTS/CTOUT_11/EMC_D2/SD_DAT0) ; port EMC_DQ1
EMC_DQ2: U5.R8(P1_10/GPIO1[3]/U1_RI/CTOUT_14/EMC_D3/SD_DAT1) ; port EMC_DQ2
EMC_DQ3: U5.T9(P1_11/GPIO1[4]/U1_CTS/CTOUT_15/EMC_D4/SD_DAT2) ; port EMC_DQ3
EMC_DQ4: U5.R9(P1_12/GPIO1[5]/U1_DCD/EMC_D5/T0_CAP1/SGPIO8/SD_DAT3) ; port EMC_DQ4
EMC_DQ5: U5.R10(P1_13/GPIO1[6]/U1_TXD/EMC_D6/T0_CAP0/SGPIO9/SD_CD) ; port EMC_DQ5
EMC_DQ6: U5.R11(P1_14/GPIO1[7]/U1_RXD/EMC_D7/T0_MAT2/SGPIO10) ; port EMC_DQ6
EMC_DQ7: U5.P9(P5_4/GPIO2[13]/MCOB0/EMC_D8/U1_CTS/T1_MAT0) ; port EMC_DQ7
EMC_DQ8: U5.P10(P5_5/GPIO2[14]/MCOA1/EMC_D9/U1_DCD/T1_MAT1) ; port EMC_DQ8
EMC_DQ9: U5.T13(P5_6/GPIO2[15]/MCOB1/EMC_D10/U1_TXD/T1_MAT2) ; port EMC_DQ9
EMC_DQ10: U5.R12(P5_7/GPIO2[7]/MCOA2/EMC_D11/U1_RXD/T1_MAT3) ; port EMC_DQ10
EMC_DQ11: U5.N3(P5_0/GPIO2[9]/MCOB2/EMC_D12/U1_DSR/T1_CAP0) ; port EMC_DQ11
EMC_DQ12: U5.P3(P5_1/GPIO2[10]/MCI2/EMC_D13/U1_DTR/T1_CAP1) ; port EMC_DQ12
EMC_DQ13: U5.R4(P5_2/GPIO2[11]/MCI1/EMC_D14/U1_RTS/T1_CAP2) ; port EMC_DQ13
EMC_DQ14: U5.T8(P5_3/GPIO2[12]/MCI0/EMC_D15/U1_RI/T1_CAP3) ; port EMC_DQ14
EMC_DQ15: U5.R1(PD_2/CTOUT_7/EMC_D16/GPIO6[16]/SGPIO6) ; port EMC_DQ15
I2C_CLK: U5.L15(I2C0_SCL) ; port CL/IWL
I2C_Data: U5.L16(I2C0_SDA) ; port DI/DEEMPH
Latch_Enable: U5.L14(P6_6/GPIO0[5]/~{EMC_BLS1}/SGPIO5/USB0_PWR_FAULT/T2_CAP3) ; port CE/I2S
LDQM: U5.G15(P6_12/GPIO2[8]/CTOUT_7/EMC_DQMOUT0) ; port LDQM
MODE: U5.L13(P6_2/GPIO3[1]/EMC_CKEOUT1/U0_DIR/I2S0_RX_SDA/T2_CAP1) ; port MODE
RAS#: U5.P16(P6_5/GPIO3[4]/CTOUT_6/U0_RXD/~{EMC_RAS}) ; port RAS#
RESET: C29.2 JTAG/DEBUG1.10 R12.1 RESET1.1 U5.D9(~{RESET}) ; port RESET
RTCX1: C35.2 U5.A8(RTCX1) X2.1 ; port RTCX1
RTCX2: C36.2 U5.B8(RTCX2) X2.2 ; port RTCX2
Shield_SCL: U5.K11(P2_4/SGPIO13/I2C1_SCL/U3_RXD/CTIN_0/GPIO5[4]/T3_MAT1/USB0_PWR_FAULT) ; port Shield_SCL
Shield_SDA: U5.J12(P2_3/SGPIO12/I2C1_SDA/U3_TXD/CTIN_1/GPIO5[3]/T3_MAT0/USB0_PPWR) ; port Shield_SDA
SSP_CS: SSP1.5 U5.E9(PF_5/U3_UCLK/SSP1_SSEL/TRACEDATA[0]/GPIO7[19]/SGPIO4/ADC1_4) ; port SSP_CS
SSP_MISO: SSP1.1 ; port SSP_MISO
SSP_MOSI: SSP1.4 U5.M2(P0_1/GPIO0[1]/SSP1_MOSI/ENET_COL/SGPIO1/ENET_TX_EN/I2S1_TX_SDA) ; port SSP_MOSI
SSP_SCK: SSP1.3 U5.D10(PF_4/SSP1_SCK/GP_CLKIN/TRACECLK/I2S0_TX_MCLK/I2S0_RX_SCK) ; port SSP_SCK
STATUS_BLUE: R24.2 ; port STATUS_BLUE
STATUS_GREEN: R23.1 ; port STATUS_GREEN
STATUS_RED: R25.1 ; port STATUS_RED
TCK/SWDCLK: JTAG/DEBUG1.4 R18.1 U5.J5(TCK/SWDCLK) ; port TCK/SWDCLK
TDI: JTAG/DEBUG1.8 U5.J4(TDI) ; port TDI
TDO/SWO: JTAG/DEBUG1.6 R17.1 U5.K5(TDO/SWO) ; port TDO/SWO
TMS/SWDIO: JTAG/DEBUG1.2 U5.K6(TMS/SWDIO) ; port TMS/SWDIO
TRST: R13.1 U5.M4(~{TRST}) ; port TRST
UDQM: U5.H15(P6_10/GPIO3[6]/~{MCABORT}/EMC_DQMOUT1) ; port UDQM
USB0_N: U5.G2(USB0_DM) ; port USB_N
USB0_P: U5.F2(USB0_DP) ; port USB_P
USER_STATUS_BLUE: R28.2 ; port USER_STATUS_BLUE
USER_STATUS_GREEN: R26.1 ; port USER_STATUS_GREEN
USER_STATUS_RED: R30.1 ; port USER_STATUS_RED
VDDA: C33.2 C34.2 FB5.2 U5.B4(VDDA) ; port VDDA, port ADC_REF
VSSA: C33.1 C34.1 FB6.2 U5.B2(VSSA) ; port VSSA
WE#: U5.T4(P1_6/GPIO1[9]/CTIN_5/~{EMC_WE}/SGPIO14/SD_CMD) ; port WE#
NetC24_2: C24.2 FB2.2 U5.F3(USB0_VDDA3V3_DRIVER)
NetC25_2: C25.2 FB1.2 U5.G3(USB0_VDDA3V3)
NetC30_1: C30.1 U5.E1(XTAL2) X1.3 ; port XTAL2
NetC31_2: C31.2 U5.D1(XTAL1) X1.1 ; port XTAL1
NetDBGEN1_2: DBGEN1.2 R15.2 R16.2
NetFB3_1: FB3.1 U5.G1(USB0_VSSA_REF)
NetFB4_1: FB4.1 U5.H3(USB0_VSSA_TERM)
NetJ3_4: U5.H2(USB0_ID) ; port USB_ID
NetQ1_3: U5.F1(USB0_VBUS) ; port USB_VBUS
NetR6_2: U5.J13(P6_7/EMC_A15/SGPIO6/USB0_IND1/GPIO5[15]/T2_MAT0) ; port ZFLAGR
NetR7_2: U5.H13(P6_8/EMC_A14/SGPIO7/USB0_IND0/GPIO5[16]/T2_MAT1) ; port ZFLAGL
NetR8_2: R8.2 U5.H1(USB0_RREF)
NetR13_2: R13.2 R14.2 TRST1.2
NetR15_1: R15.1 U5.L4(DBGEN) ; port DBGEN
NetR23_2: R23.2 STATUS.3(Green)
NetR24_1: R24.1 STATUS.4(Blue)
NetR25_2: R25.2 STATUS.2(Red)
NetR26_2: R26.2 USER_STATUS.3(Green)
NetR28_1: R28.1 USER_STATUS.4(Blue)
NetR30_2: R30.2 USER_STATUS.2(Red)
NetR34_2: U5.B3(ADC0_5/ADC1_5) ; port AN0
NetR35_2: U5.A4(ADC0_2/ADC1_2) ; port AN1
NetR36_2: U5.C3(ADC0_1/ADC1_1) ; port AN2
NetR37_2: U5.C6(ADC0_4/ADC1_4) ; port AN3
NetR38_2: U5.E3(ADC0_0/ADC1_0/DAC) ; port AN4
NetR39_2: U5.B5(ADC0_3/ADC1_3) ; port AN5
NetRTCALARM1_1: RTCALARM1.1 U5.A11(RTC_ALARM)
NetU5_A9: U5.A9(WAKEUP0) WAKEUP0.1
NetU5_A10: U5.A10(WAKEUP1) WAKEUP1.1
NetU5_A15: U5.A15(P3_4/GPIO1[14]/SPIFI_SIO3/U1_TXD/I2S0_TX_WS/I2S1_RX_SDA) ; port SPIFI_SIO3
NetU5_B13: U5.B13(P3_6/GPIO0[6]/SPI_MISO/SSP0_SSEL/SPIFI_MISO/SSP0_MISO) ; port SPIFI_MISO
NetU5_B14: U5.B14(P3_3/SPI_SCK/SSP0_SCK/SPIFI_SCK/CGU_OUT1/I2S0_TX_MCLK/I2S1_TX_SCK) ; port SPIFI_SCK
NetU5_C9: U5.C9(WAKEUP2) WAKEUP2.1
NetU5_C10: U5.C10(P3_8/SPI_SSEL/SSP0_MOSI/SPIFI_CS/GPIO5[11]/SSP0_SSEL) ; port SPIFI_CS
NetU5_C11: U5.C11(P3_7/SPI_MOSI/SSP0_MISO/SPIFI_MOSI/GPIO5[10]/SSP0_MOSI) ; port SPIFI_MOSI
NetU5_C12: U5.C12(P3_5/GPIO1[15]/SPIFI_SIO2/U1_RXD/I2S0_TX_SDA/I2S1_RX_WS) ; port SPIFI_SIO2
NetU5_D8: U5.D8(WAKEUP3) WAKEUP3.1

Not connected (* = marked no-connect by the designer): JTAG/DEBUG1 7*; U5 A1(P4_1/GPIO2[1]/CTOUT_1/U3_TXD/ENET_COL/ADC0_1) A2(PF_11/U0_RXD/GPIO7[25]/SD_VOLT2/ADC1_5) A3(PF_10/U0_TXD/GPIO7[24]/SD_WP/ADC0_5) A5(ADC0_6/ADC1_6) A6(PB_6/USB1_ULPI_D3/GPIO5[26]/CTIN_6/ADC0_6) A7(P7_5/GPIO3[13]/CTOUT_12/TRACEDATA[1]/ADC0_3) A12(PB_5/USB1_ULPI_D4/GPIO5[25]/CTIN_7) A13(PB_3/USB1_ULPI_D6/GPIO5[23]/CTOUT_8) A14(PB_1/USB1_ULPI_DIR/GPIO5[21]/CTOUT_6) A16(P7_2/GPIO3[10]/CTIN_4/I2S0_TX_SDA/U2_RXD/SGPIO6) B1(P4_4/GPIO2[4]/CTOUT_2/U3_DIR/SGPIO10/DAC) B6(P7_7/GPIO3[15]/CTOUT_8/TRACEDATA[3]/ENET_MDC/SGPIO7/ADC1_6) B7(PF_7/U3_BAUD/SSP1_MOSI/TRACEDATA[2]/GPIO7[21]/SGPIO6/I2S1_TX_WS/ADC1_7) B9(NC)* B11(PB_4/USB1_ULPI_D5/GPIO5[24]/CTIN_5) B12(PB_2/USB1_ULPI_D7/GPIO5[22]/CTOUT_7) B15(PB_0/CTOUT_10/GPIO5[20]) B16(P7_0/GPIO3[8]/CTOUT_14/SGPIO4) C1(P4_6/GPIO2[6]/CTOUT_4/SGPIO12) C2(P4_3/GPIO2[3]/CTOUT_3/U3_BAUD/SGPIO9/ADC0_0) C5(ADC0_7/ADC1_7) C7(P7_6/GPIO3[14]/CTOUT_11/TRACEDATA[2]) C8(P7_4/GPIO3[12]/CTOUT_13/TRACEDATA[0]/ADC0_4) C13(P7_3/GPIO3[11]/CTIN_3) C15(PE_14/~{EMC_DYCS3}/GPIO7[14]) D2(P4_5/GPIO2[5]/CTOUT_5/SGPIO11) D3(P4_2/GPIO2[2]/CTOUT_0/U3_RXD/SGPIO8) D4(PC_0/USB1_ULPI_CLK/ENET_RX_CLK/SD_CLK/ADC1_1) D5(P4_0/GPIO2[0]/MCOA0/NMI/U3_UCLK) D6(PF_9/U0_DIR/CTOUT_1/GPIO7[23]/SGPIO3/ADC1_2) D11(PF_2/U3_TXD/SSP0_MISO/GPIO7[17]/SGPIO1) D12(PF_0/SSP0_SCK/GP_CLKIN/I2S1_TX_MCLK) D15(PE_12/CTOUT_11/U1_RXD/EMC_D31/GPIO7[12]) D16(PE_11/CTOUT_12/U1_TXD/EMC_D30/GPIO7[11]) E2(P4_8/CTIN_5/GPIO5[12]/CAN1_TD/SGPIO13) E4(PC_1/USB1_ULPI_D7/U1_RI/ENET_MDC/GPIO6[0]/T3_CAP0/SD_VOLT0) E5(P8_0/GPIO4[0]/USB0_PWR_FAULT/MCI2/SGPIO8/T0_MAT0) E6(PF_8/U0_UCLK/CTIN_2/TRACEDATA[3]/GPIO7[22]/SGPIO7/ADC0_2) E7(PF_6/U3_DIR/SSP1_MISO/TRACEDATA[1]/GPIO7[20]/SGPIO5/I2S1_TX_SDA/ADC1_3) E8(VPP)* E10(PF_3/U3_RXD/SSP0_MOSI/GPIO7[18]/SGPIO2) E11(PF_1/SSP0_SSEL/GPIO7[16]/SGPIO0) E13(PE_15/CTOUT_0/I2C1_SCL/EMC_CKEOUT3/GPIO7[15]) E14(PE_10/CTIN_3/U1_DTR/EMC_D29/GPIO7[10]) E16(PE_9/CTIN_4/U1_DCD/EMC_D28/GPIO7[9]) F4(PC_4/USB1_ULPI_D4/ENET_TX_EN/GPIO6[3]/T3_CAP1/SD_DAT0) F5(PC_3/USB1_ULPI_D5/U1_RTS/ENET_TXD3/GPIO6[2]/SD_VOLT1/ADC1_0) F6(PC_2/USB1_ULPI_D6/U1_CTS/ENET_TXD2/GPIO6[1]/SD_RST) F12(USB1_DP)* F14(PE_8/CTOUT_4/U1_DSR/EMC_D27/GPIO7[8]) F15(PE_7/CTOUT_5/U1_CTS/EMC_D26/GPIO7[7]) G4(PC_5/USB1_ULPI_D3/ENET_TX_ER/GPIO6[4]/T3_CAP2/SD_DAT1) G5(PC_7/USB1_ULPI_D1/ENET_RXD3/GPIO6[6]/T3_MAT0/SD_DAT3) G12(USB1_DM)* G13(PA_4/CTOUT_9/EMC_A23/GPIO5[19]) G14(PE_13/CTOUT_14/I2C1_SDA/EMC_DQMOUT3/GPIO7[13]) H5(P8_1/GPIO4[1]/USB0_IND1/MCI1/SGPIO9/T0_MAT1) H6(PC_6/USB1_ULPI_D2/ENET_RXD2/GPIO6[5]/T3_CAP3/SD_DAT2) H11(PA_3/GPIO4[10]/QEI_PHA) J1(P8_5/GPIO4[5]/USB1_ULPI_D0/T0_CAP1) J2(P8_4/GPIO4[4]/USB1_ULPI_D1/T0_CAP0) J3(P8_3/GPIO4[3]/USB1_ULPI_D2/T0_MAT3) J14(PA_1/GPIO4[8]/QEI_IDX/U2_TXD) J15(P6_9/GPIO3[5]/~{EMC_DYCS0}/T2_MAT2) K1(P8_7/GPIO4[7]/USB1_ULPI_STP/T0_CAP3) K2(PC_9/USB1_ULPI_NXT/ENET_RX_ER/GPIO6[8]/T3_MAT2/SD_POW) K3(P8_6/GPIO4[6]/USB1_ULPI_NXT/T0_CAP2) K4(P8_2/GPIO4[2]/USB0_IND0/MCI0/SGPIO10/T0_MAT2) K12(PE_3/CAN0_TD/ADCTRIG1/EMC_A21/GPIO7[3]) K13(PE_4/NMI/EMC_A22/GPIO7[4]) K14(P2_5/SGPIO14/CTIN_2/USB1_VBUS/ADCTRIG1/GPIO5[5]/T3_MAT2/USB0_IND0) K15(PA_2/GPIO4[9]/QEI_PHB/U2_RXD) L1(P8_8/USB1_ULPI_CLK/CGU_OUT0/I2S1_TX_MCLK) L2(P4_9/CTIN_6/GPIO5[13]/CAN1_RD/SGPIO14) L3(P0_0/GPIO0[0]/SSP1_MISO/ENET_RXD1/SGPIO0/I2S0_TX_WS/I2S1_TX_WS) L5(PC_11/USB1_ULPI_DIR/U1_DCD/GPIO6[10]/SD_DAT4) L6(PC_12/U1_DTR/GPIO6[11]/SGPIO11/I2S0_TX_SDA/SD_DAT5) L11(P9_6/GPIO4[11]/MCOB1/USB1_PWR_FAULT/ENET_COL/SGPIO8/U0_RXD) L12(PA_0/I2S1_RX_MCLK/CGU_OUT1) M1(PC_13/U1_TXD/GPIO6[12]/SGPIO12/I2S0_TX_WS/SD_DAT6) M3(P4_10/CTIN_2/GPIO5[14]/SGPIO15) M5(PC_10/USB1_ULPI_STP/U1_DSR/GPIO6[9]/T3_MAT3/SD_CMD) M6(P9_3/GPIO4[15]/MCOA0/USB1_IND1/ENET_RXD2/SGPIO9/U3_TXD) M7(P1_16/GPIO0[3]/U2_RXD/SGPIO3/ENET_CRS/T0_MAT0/ENET_RX_DV) M8(P1_17/GPIO0[12]/U2_UCLK/ENET_MDIO/T0_CAP3/CAN1_TD/SGPIO11) M9(P9_5/MCOA1/USB1_PPWR/GPIO5[18]/ENET_TXD3/SGPIO3/U0_TXD) M10(P1_20/GPIO0[15]/SSP1_SSEL/ENET_TXD1/T0_CAP2/SGPIO13) M12(P6_0/I2S0_RX_MCLK/I2S0_RX_SCK) M14(PE_2/ADCTRIG0/CAN0_RD/EMC_A20/GPIO7[2]) M16(PE_6/CTOUT_2/U1_RI/EMC_D25/GPIO7[6]) N1(PC_14/U1_RXD/GPIO6[13]/SGPIO13/ENET_TX_ER/SD_DAT7) N2(PD_0/CTOUT_15/EMC_DQMOUT2/GPIO6[14]/SGPIO4) N4(PC_8/USB1_ULPI_D0/ENET_RX_DV/GPIO6[7]/T3_MAT1/SD_CD) N5(CLK0/EMC_CLK0/CLKOUT/SD_CLK/EMC_CLK01/SSP1_SCK/ENET_TX_CLK(ENET_REF_CLK)) N6(P9_1/GPIO4[13]/MCOA2/I2S0_TX_WS/ENET_RX_ER/SGPIO1/SSP0_MISO) N9(PD_11/~{EMC_CS3}/GPIO6[25]/USB1_ULPI_D0/CTOUT_14) N10(P9_4/MCOB0/USB1_IND0/GPIO5[17]/ENET_TXD2/SGPIO4/U3_RXD) N12(P1_18/GPIO0[13]/U2_DIR/ENET_TXD0/T0_MAT3/CAN1_RD/SGPIO12) N14(PE_1/EMC_A19/GPIO7[1]/CAN1_RD) N15(P2_1/SGPIO5/U0_RXD/EMC_A12/USB0_PWR_FAULT/GPIO5[1]/T3_CAP1) N16(PE_5/CTOUT_3/U1_RTS/EMC_D24/GPIO7[5]) P1(PD_1/EMC_CKEOUT2/GPIO6[15]/SD_POW/SGPIO5) P4(PD_3/CTOUT_6/EMC_D17/GPIO6[17]/SGPIO7) P5(P1_3/GPIO0[10]/CTOUT_8/SGPIO10/~{EMC_OE}/USB0_IND1/SSP1_MISO/SD_RST) P6(PD_5/CTOUT_9/EMC_D19/GPIO6[19]/SGPIO9) P8(PD_8/CTIN_6/EMC_D22/GPIO6[22]/SGPIO12) P11(PD_10/CTIN_1/~{EMC_BLS3}/GPIO6[24]) P12(CLK3/EMC_CLK2/CLKOUT/CGU_OUT1/I2S1_RX_SCK) P14(PE_0/EMC_A18/GPIO7[0]/CAN1_TD) R6(PD_6/CTOUT_10/EMC_D20/GPIO6[20]/SGPIO10) R7(P1_8/GPIO1[1]/U1_DTR/CTOUT_12/EMC_D1/SD_VOLT0) R13(PD_14/~{EMC_DYCS2}/GPIO6[28]/CTOUT_11) R14(PD_16/EMC_A16/GPIO6[30]/SD_VOLT2/CTOUT_12) R15(P6_1/GPIO3[0]/~{EMC_DYCS1}/U0_UCLK/I2S0_RX_WS/T2_CAP0) T1(P9_0/GPIO4[12]/~{MCABORT}/ENET_CRS/SGPIO0/SSP0_SSEL) T2(PD_4/CTOUT_8/EMC_D18/GPIO6[18]/SGPIO8) T3(P1_4/GPIO0[11]/CTOUT_9/SGPIO11/~{EMC_BLS0}/USB0_IND0/SSP1_MOSI/SD_VOLT1) T6(PD_7/CTIN_5/EMC_D21/GPIO6[21]/SGPIO11) T11(PD_9/CTOUT_13/EMC_D23/GPIO6[23]/SGPIO13) T12(P1_15/GPIO0[2]/U2_TXD/SGPIO2/ENET_RXD0/T0_MAT1) T14(PD_13/CTIN_0/~{EMC_BLS2}/GPIO6[27]/CTOUT_13) T15(PD_15/EMC_A17/GPIO6[29]/SD_WP/CTOUT_8) T16(P2_0/SGPIO4/U0_TXD/EMC_A13/USB0_PPWR/GPIO5[0]/T3_CAP0/ENET_MDC)

### Notes on the sheet
- ADC Supply
- Clock Cyrstal Oscillator
- RTC Oscillator
- Reset
- (near C27) JTAG Interface Test Reset
- Debug Enable
- LPC4337 Bypass Power Bypass

### Library data of the parts
C24 C25 C27-C49 C62 C80-C83 = Cap Semi: Capacitor (Semiconductor SIM Model); Published: 8-Jun-2000; LatestRevisionDate: 29-May-2009; LatestRevisionNote: IPC-7351 Footprint Added.; PackageReference: C1206; Publisher: Altium Limited; PackageDescription: Chip Capacitor
DBGEN1 TRST1 = Header 2: Header, 2-Pin; LatestRevisionDate: 17-Jul-2002; LatestRevisionNote: Re-released for DXP Platform.; Publisher: Altium Limited
R8 R12-R18 R23-R26 R28 R30 = Res3: Resistor; Published: 8-Jun-2000; LatestRevisionDate: 29-May-2009; LatestRevisionNote: IPC-7351 Footprint Added.; PackageReference: J1-0603; Publisher: Altium Limited; PackageDescription: Chip Resistor
SSP1 = Header 3X2: Header, 3-Pin, Dual row; LatestRevisionDate: 17-Jul-2002; LatestRevisionNote: Re-released for DXP Platform.; Publisher: Altium Limited
STATUS USER_STATUS = RGB LED APTF1616SEEZGQBDC: RGB LED
U5 = LPC4330FET256: 32-bit ARM Cortex-M4 MCU, 264 kB SRAM, 2 HS USB with on-chip PHY, Ethernet, CAN, AES, SPIFI, SGPIO, SCT, 256-Pin LBGA; fmax: 204 MHz; GPIOs: 164; SRAM: 264 kB; ROM: 64 kB; Ethernet: Y; USB: 2; ADC channels: 8; SPI: 1; UART: 4; VDD (min): 2.2 V; VDD (max): 3.6 V; DatasheetVersion: Rev.3.1, Jan-2012; PackageVersion: Aug-2005; PackageReference: SOT740-2; PackageDescription: LBGA256: Plastic Low Profile Ball Grid Array Package; 256 Balls; Body 17 x 17 x 1 mm; PWM: Y; QEI: Y; PLL: Y; I2C: 2; CAN: 2; Timers: 4; Code_JEDEC: MO-192; ComponentLink1Description: Manufacturer URL; ComponentLink1URL: http://www.nxp.com/; ComponentLink2Description: Datasheet; ComponentLink2URL: http://www.nxp.com/documents/data_sheet/LPC4350_30_20_10.pdf
X2 = ABS07-32.768KHZ-T: ABS07-32.768KHZ-T RTC Crystal Oscillator
RTCALARM1 WAKEUP0-WAKEUP3 = Socket: LatestRevisionDate: 17-Jul-2002; LatestRevisionNote: Re-released for DXP Platform.; Publisher: Altium Limited

## Sheet Mako DSP Arduio IO R2.1.SchDoc
size A
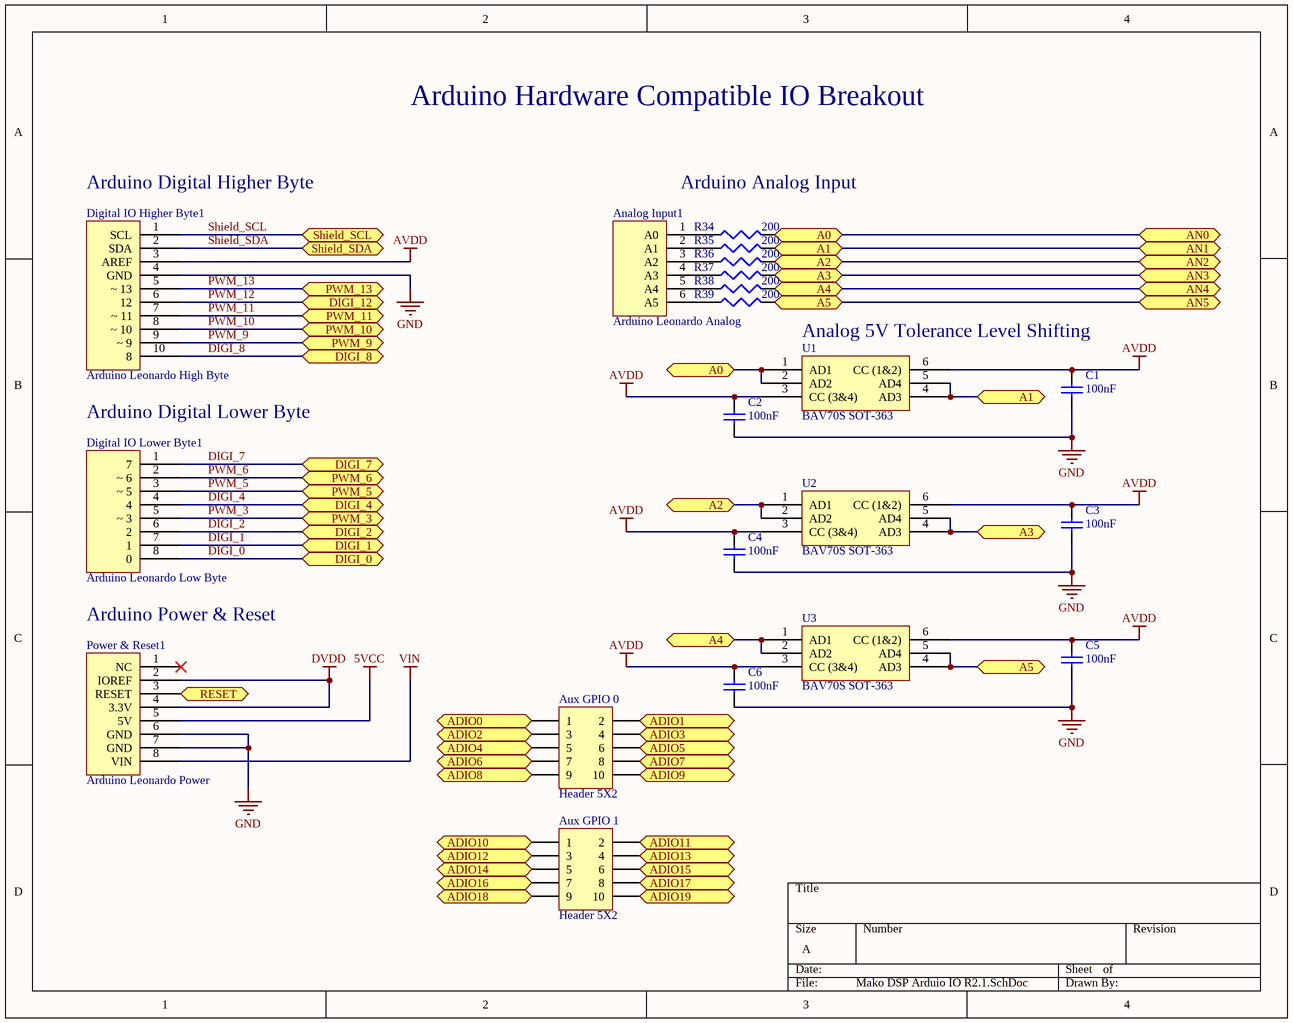
[diagram p4: Mako DSP Arduio IO R2.1.SchDoc]

### Parts
Analog_Input1  Arduino Leonardo Analog  [Arduino Leonardo Analog]
Aux_GPIO_0  Header 5X2  [HDR2X5]
Aux_GPIO_1  Header 5X2  [HDR2X5]
C1  value 100nF  [0402]  (hidden comment: Cap Semi)
C2  value 100nF  [0402]  (hidden comment: Cap Semi)
C3  value 100nF  [0402]  (hidden comment: Cap Semi)
C4  value 100nF  [0402]  (hidden comment: Cap Semi)
C5  value 100nF  [0402]  (hidden comment: Cap Semi)
C6  value 100nF  [0402]  (hidden comment: Cap Semi)
Digital_IO_Higher_Byte1  Arduino Leonardo High Byte  [Arduino Leonardo High Byte]
Digital_IO_Lower_Byte1  Arduino Leonardo Low Byte  [Arduino Leonardo Low Byte]
Power_&_Reset1  Arduino Leonardo Power  [Arduino Leonardo Power]
R34  value 200  [0402 - duplicate]  (hidden comment: Res3)
R35  value 200  [0402 - duplicate]  (hidden comment: Res3)
R36  value 200  [0402 - duplicate]  (hidden comment: Res3)
R37  value 200  [0402 - duplicate]  (hidden comment: Res3)
R38  value 200  [0402 - duplicate]  (hidden comment: Res3)
R39  value 200  [0402 - duplicate]  (hidden comment: Res3)
U1  BAV70S SOT-363  [BAV70S_SOT363]
U2  BAV70S SOT-363  [BAV70S_SOT363]
U3  BAV70S SOT-363  [BAV70S_SOT363]

### Ports
A0 (bidir), A1 (bidir), A2 (bidir), A3 (bidir), A4 (bidir), A5 (bidir), ADIO0 (bidir), ADIO1 (bidir), ADIO2 (bidir), ADIO3 (bidir), ADIO4 (bidir), ADIO5 (bidir), ADIO6 (bidir), ADIO7 (bidir), ADIO8 (bidir), ADIO9 (bidir), ADIO10 (bidir), ADIO11 (bidir), ADIO12 (bidir), ADIO13 (bidir), ADIO14 (bidir), ADIO15 (bidir), ADIO16 (bidir), ADIO17 (bidir), ADIO18 (bidir), ADIO19 (bidir), AN0 (bidir), AN1 (bidir), AN2 (bidir), AN3 (bidir), AN4 (bidir), AN5 (bidir), DIGI_0 (bidir), DIGI_1 (bidir), DIGI_2 (bidir), DIGI_4 (bidir), DIGI_7 (bidir), DIGI_8 (bidir), DIGI_12 (bidir), PWM_3 (bidir), PWM_5 (bidir), PWM_6 (bidir), PWM_9 (bidir), PWM_10 (bidir), PWM_11 (bidir), PWM_13 (bidir), RESET (bidir), Shield_SCL (bidir), Shield_SDA (bidir)

### Nets
5VCC: Power_&_Reset1.5(5V)
AVDD: C1.2 C2.2 C3.2 C4.2 C5.2 C6.2 Digital_IO_Higher_Byte1.3(AREF) U1.3(CC_(3&4)) U1.6(CC_(1&2)) U2.3(CC_(3&4)) U2.6(CC_(1&2)) U3.3(CC_(3&4)) U3.6(CC_(1&2))
DVDD: Power_&_Reset1.2(IOREF) Power_&_Reset1.4(3.3V)
GND: C1.1 C2.1 C3.1 C4.1 C5.1 C6.1 Digital_IO_Higher_Byte1.4(GND) Power_&_Reset1.6(GND) Power_&_Reset1.7(GND)
VIN: Power_&_Reset1.8(VIN)
DIGI_0: Digital_IO_Lower_Byte1.8(0) ; port DIGI_0
DIGI_1: Digital_IO_Lower_Byte1.7(1) ; port DIGI_1
DIGI_2: Digital_IO_Lower_Byte1.6(2) ; port DIGI_2
DIGI_4: Digital_IO_Lower_Byte1.4 ; port DIGI_4
DIGI_7: Digital_IO_Lower_Byte1.1(7) ; port DIGI_7
DIGI_8: Digital_IO_Higher_Byte1.10(8) ; port DIGI_8
PWM_3: Digital_IO_Lower_Byte1.5(~_3) ; port PWM_3
PWM_5: Digital_IO_Lower_Byte1.3(~_5) ; port PWM_5
PWM_6: Digital_IO_Lower_Byte1.2(~_6) ; port PWM_6
PWM_9: Digital_IO_Higher_Byte1.9(~_9) ; port PWM_9
PWM_10: Digital_IO_Higher_Byte1.8(~_10) ; port PWM_10
PWM_11: Digital_IO_Higher_Byte1.7(~_11) ; port PWM_11
PWM_12: Digital_IO_Higher_Byte1.6(12) ; port DIGI_12
PWM_13: Digital_IO_Higher_Byte1.5(~_13) ; port PWM_13
RESET: Power_&_Reset1.3(RESET) ; port RESET
Shield_SCL: Digital_IO_Higher_Byte1.1(SCL) ; port Shield_SCL
Shield_SDA: Digital_IO_Higher_Byte1.2(SDA) ; port Shield_SDA
NetAnalog_Input1_1: Analog_Input1.1(A0) R34.1
NetAnalog_Input1_2: Analog_Input1.2(A1) R35.1
NetAnalog_Input1_3: Analog_Input1.3(A2) R36.1
NetAnalog_Input1_4: Analog_Input1.4(A3) R37.1
NetAnalog_Input1_5: Analog_Input1.5(A4) R38.1
NetAnalog_Input1_6: Analog_Input1.6(A5) R39.1
NetAux_GPIO_0_1: Aux_GPIO_0.1 ; port ADIO0
NetAux_GPIO_0_2: Aux_GPIO_0.2 ; port ADIO1
NetAux_GPIO_0_3: Aux_GPIO_0.3 ; port ADIO2
NetAux_GPIO_0_4: Aux_GPIO_0.4 ; port ADIO3
NetAux_GPIO_0_5: Aux_GPIO_0.5 ; port ADIO4
NetAux_GPIO_0_6: Aux_GPIO_0.6 ; port ADIO5
NetAux_GPIO_0_7: Aux_GPIO_0.7 ; port ADIO6
NetAux_GPIO_0_8: Aux_GPIO_0.8 ; port ADIO7
NetAux_GPIO_0_9: Aux_GPIO_0.9 ; port ADIO8
NetAux_GPIO_0_10: Aux_GPIO_0.10 ; port ADIO9
NetAux_GPIO_1_1: Aux_GPIO_1.1 ; port ADIO10
NetAux_GPIO_1_2: Aux_GPIO_1.2 ; port ADIO11
NetAux_GPIO_1_3: Aux_GPIO_1.3 ; port ADIO12
NetAux_GPIO_1_4: Aux_GPIO_1.4 ; port ADIO13
NetAux_GPIO_1_5: Aux_GPIO_1.5 ; port ADIO14
NetAux_GPIO_1_6: Aux_GPIO_1.6 ; port ADIO15
NetAux_GPIO_1_7: Aux_GPIO_1.7 ; port ADIO16
NetAux_GPIO_1_8: Aux_GPIO_1.8 ; port ADIO17
NetAux_GPIO_1_9: Aux_GPIO_1.9 ; port ADIO18
NetAux_GPIO_1_10: Aux_GPIO_1.10 ; port ADIO19
NetR34_2: R34.2 U1.1(AD1) U1.2(AD2) ; port AN0, port A0
NetR35_2: R35.2 U1.4(AD3) U1.5(AD4) ; port AN1, port A1
NetR36_2: R36.2 U2.1(AD1) U2.2(AD2) ; port AN2, port A2
NetR37_2: R37.2 U2.4(AD3) U2.5(AD4) ; port AN3, port A3
NetR38_2: R38.2 U3.1(AD1) U3.2(AD2) ; port AN4, port A4
NetR39_2: R39.2 U3.4(AD3) U3.5(AD4) ; port AN5, port A5

Not connected (* = marked no-connect by the designer): Power_&_Reset1 1(NC)*

### Notes on the sheet
- Arduino Hardware Compatible IO Breakout
- (near Digital_IO_Higher_Byte1) Arduino Digital Higher Byte
- Arduino Analog Input
- Analog 5V Tolerance Level Shifting
- Arduino Digital Lower Byte
- Arduino Power & Reset

### Library data of the parts
Aux_GPIO_0 Aux_GPIO_1 = Header 5X2: Header, 5-Pin, Dual row; LatestRevisionDate: 17-Jul-2002; LatestRevisionNote: Re-released for DXP Platform.; Publisher: Altium Limited
C1-C6 = Cap Semi: Capacitor (Semiconductor SIM Model); Published: 8-Jun-2000; LatestRevisionDate: 29-May-2009; LatestRevisionNote: IPC-7351 Footprint Added.; PackageReference: C1206; Publisher: Altium Limited; PackageDescription: Chip Capacitor
R34-R39 = Res3: Resistor; Published: 8-Jun-2000; LatestRevisionDate: 29-May-2009; LatestRevisionNote: IPC-7351 Footprint Added.; PackageReference: J1-0603; Publisher: Altium Limited; PackageDescription: Chip Resistor

## Sheet Mako DSP USB R2.1.SchDoc
size A
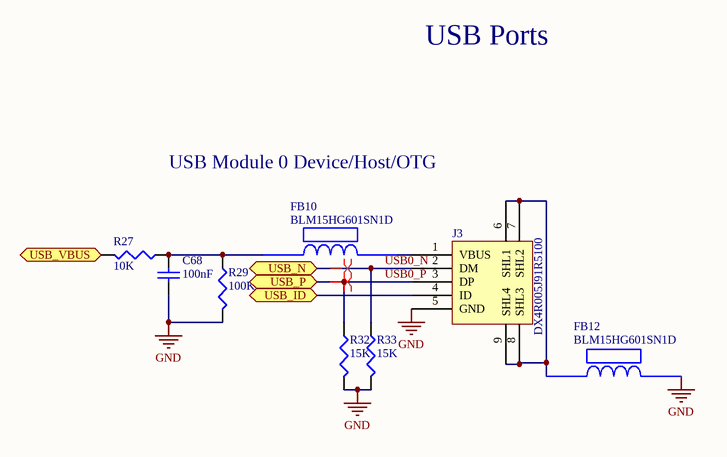
[diagram p5: Mako DSP USB R2.1.SchDoc]

### Parts
C68  value 100nF  [1608[0603]]  (hidden comment: Cap Semi)
FB10  BLM15HG601SN1D  [BLM18PG121SN1D]
FB12  BLM15HG601SN1D  [BLM18PG121SN1D]
J3  DX4R005J91R5100  [Micro USB Circular Holes Only]
R27  value 10K  [J1-0603]  (hidden comment: Res3)
R29  value 100K  [J1-0603]  (hidden comment: Res3)
R32  value 15K  [J1-0603]  (hidden comment: Res3)
R33  value 15K  [J1-0603]  (hidden comment: Res3)

### Ports
USB_ID (bidir), USB_N (bidir), USB_P (bidir), USB_VBUS (bidir)

### Nets
GND: C68.1 FB12.2 J3.5(GND) R29.2 R32.2 R33.2
USB0_N: J3.2(DM) R33.1 ; port USB_N
USB0_P: J3.3(DP) R32.1 ; port USB_P
NetC68_2: C68.2 FB10.1 R27.1 R29.1
NetFB10_2: FB10.2 J3.1(VBUS)
NetFB12_1: FB12.1 J3.6(SHL1) J3.7(SHL2) J3.8(SHL3) J3.9(SHL4)
NetJ3_4: J3.4(ID) ; port USB_ID
NetQ1_3: R27.2 ; port USB_VBUS

### Layout directives
differential pair: USB0_N, USB0_P

### Notes on the sheet
- USB Ports
- USB Module 0 Device/Host/OTG

### Library data of the parts
C68 = Cap Semi: Capacitor (Semiconductor SIM Model); Published: 8-Jun-2000; LatestRevisionDate: 29-May-2009; LatestRevisionNote: IPC-7351 Footprint Added.; PackageReference: C1206; Publisher: Altium Limited; PackageDescription: Chip Capacitor
J3 = Micro USB: Micro USB Jack B
R27 R29 R32 R33 = Res3: Resistor; Published: 8-Jun-2000; LatestRevisionDate: 29-May-2009; LatestRevisionNote: IPC-7351 Footprint Added.; PackageReference: J1-0603; Publisher: Altium Limited; PackageDescription: Chip Resistor

## Sheet Mako DSP Memory R2.1.SchDoc
size A
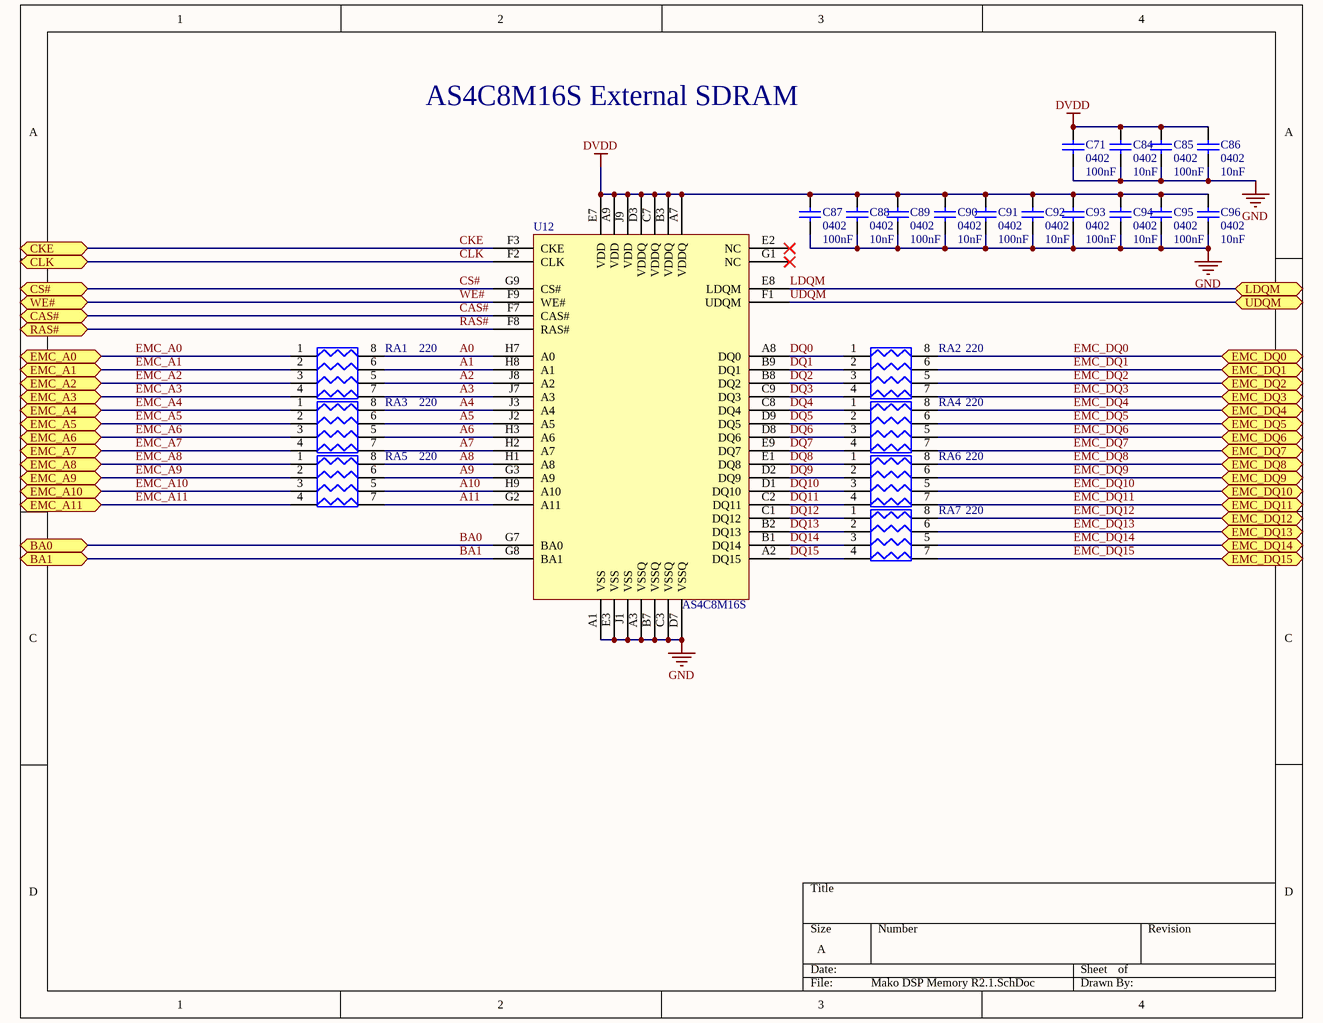
[diagram p6: Mako DSP Memory R2.1.SchDoc]

### Parts
C71  0402  value 100nF  [0402]
C84  0402  value 10nF  [0402]
C85  0402  value 100nF  [0402]
C86  0402  value 10nF  [0402]
C87  0402  value 100nF  [0402]
C88  0402  value 10nF  [0402]
C89  0402  value 100nF  [0402]
C90  0402  value 10nF  [0402]
C91  0402  value 100nF  [0402]
C92  0402  value 10nF  [0402]
C93  0402  value 100nF  [0402]
C94  0402  value 10nF  [0402]
C95  0402  value 100nF  [0402]
C96  0402  value 10nF  [0402]
RA1  value 220  [742C083]  (hidden comment: RESISTOR ARRAY)
RA2  value 220  [742C083]  (hidden comment: RESISTOR ARRAY)
RA3  value 220  [742C083]  (hidden comment: RESISTOR ARRAY)
RA4  value 220  [742C083]  (hidden comment: RESISTOR ARRAY)
RA5  value 220  [742C083]  (hidden comment: RESISTOR ARRAY)
RA6  value 220  [742C083]  (hidden comment: RESISTOR ARRAY)
RA7  value 220  [742C083]  (hidden comment: RESISTOR ARRAY)
U12  AS4C8M16S  [AS4C8M16S]

### Ports
BA0, BA1, CAS#, CKE, CLK, CS#, EMC_A0, EMC_A1, EMC_A2, EMC_A3, EMC_A4, EMC_A5, EMC_A6, EMC_A7, EMC_A8, EMC_A9, EMC_A10, EMC_A11, EMC_DQ0, EMC_DQ1, EMC_DQ2, EMC_DQ3, EMC_DQ4, EMC_DQ5, EMC_DQ6, EMC_DQ7, EMC_DQ8, EMC_DQ9, EMC_DQ10, EMC_DQ11, EMC_DQ12, EMC_DQ13, EMC_DQ14, EMC_DQ15, LDQM, RAS#, UDQM, WE#

### Nets
DVDD: C71.2 C84.2 C85.2 C86.2 C87.2 C88.2 C89.2 C90.2 C91.2 C92.2 C93.2 C94.2 C95.2 C96.2 U12.A7(VDDQ) U12.A9(VDD) U12.B3(VDDQ) U12.C7(VDDQ) U12.D3(VDDQ) U12.E7(VDD) U12.J9(VDD)
GND: C71.1 C84.1 C85.1 C86.1 C87.1 C88.1 C89.1 C90.1 C91.1 C92.1 C93.1 C94.1 C95.1 C96.1 U12.A1(VSS) U12.A3(VSSQ) U12.B7(VSSQ) U12.C3(VSSQ) U12.D7(VSSQ) U12.E3(VSS) U12.J1(VSS)
A0: RA1.8 U12.H7(A0)
A1: RA1.6 U12.H8(A1)
A2: RA1.5 U12.J8(A2)
A3: RA1.7 U12.J7(A3)
A4: RA3.8 U12.J3(A4)
A5: RA3.6 U12.J2(A5)
A6: RA3.5 U12.H3(A6)
A7: RA3.7 U12.H2(A7)
A8: RA5.8 U12.H1(A8)
A9: RA5.6 U12.G3(A9)
A10: RA5.5 U12.H9(A10)
A11: RA5.7 U12.G2(A11)
BA0: U12.G7(BA0) ; port BA0
BA1: U12.G8(BA1) ; port BA1
CAS#: U12.F7(CAS#) ; port CAS#
CKE: U12.F3(CKE) ; port CKE
CLK: U12.F2(CLK) ; port CLK
CS#: U12.G9(CS#) ; port CS#
DQ0: RA2.1 U12.A8(DQ0)
DQ1: RA2.2 U12.B9(DQ1)
DQ2: RA2.3 U12.B8(DQ2)
DQ3: RA2.4 U12.C9(DQ3)
DQ4: RA4.1 U12.C8(DQ4)
DQ5: RA4.2 U12.D9(DQ5)
DQ6: RA4.3 U12.D8(DQ6)
DQ7: RA4.4 U12.E9(DQ7)
DQ8: RA6.1 U12.E1(DQ8)
DQ9: RA6.2 U12.D2(DQ9)
DQ10: RA6.3 U12.D1(DQ10)
DQ11: RA6.4 U12.C2(DQ11)
DQ12: RA7.1 U12.C1(DQ12)
DQ13: RA7.2 U12.B2(DQ13)
DQ14: RA7.3 U12.B1(DQ14)
DQ15: RA7.4 U12.A2(DQ15)
EMC_A0: RA1.1 ; port EMC_A0
EMC_A1: RA1.2 ; port EMC_A1
EMC_A2: RA1.3 ; port EMC_A2
EMC_A3: RA1.4 ; port EMC_A3
EMC_A4: RA3.1 ; port EMC_A4
EMC_A5: RA3.2 ; port EMC_A5
EMC_A6: RA3.3 ; port EMC_A6
EMC_A7: RA3.4 ; port EMC_A7
EMC_A8: RA5.1 ; port EMC_A8
EMC_A9: RA5.2 ; port EMC_A9
EMC_A10: RA5.3 ; port EMC_A10
EMC_A11: RA5.4 ; port EMC_A11
EMC_DQ0: RA2.8 ; port EMC_DQ0
EMC_DQ1: RA2.6 ; port EMC_DQ1
EMC_DQ2: RA2.5 ; port EMC_DQ2
EMC_DQ3: RA2.7 ; port EMC_DQ3
EMC_DQ4: RA4.8 ; port EMC_DQ4
EMC_DQ5: RA4.6 ; port EMC_DQ5
EMC_DQ6: RA4.5 ; port EMC_DQ6
EMC_DQ7: RA4.7 ; port EMC_DQ7
EMC_DQ8: RA6.8 ; port EMC_DQ8
EMC_DQ9: RA6.6 ; port EMC_DQ9
EMC_DQ10: RA6.5 ; port EMC_DQ10
EMC_DQ11: RA6.7 ; port EMC_DQ11
EMC_DQ12: RA7.8 ; port EMC_DQ12
EMC_DQ13: RA7.6 ; port EMC_DQ13
EMC_DQ14: RA7.5 ; port EMC_DQ14
EMC_DQ15: RA7.7 ; port EMC_DQ15
LDQM: U12.E8(LDQM) ; port LDQM
RAS#: U12.F8(RAS#) ; port RAS#
UDQM: U12.F1(UDQM) ; port UDQM
WE#: U12.F9(WE#) ; port WE#

Not connected (* = marked no-connect by the designer): U12 E2(NC)* G1(NC)*

### Notes on the sheet
- AS4C8M16S External SDRAM

### Library data of the parts
C71 C84-C96 = Cap Semi: Capacitor (Semiconductor SIM Model); Published: 8-Jun-2000; LatestRevisionDate: 29-May-2009; LatestRevisionNote: IPC-7351 Footprint Added.; PackageReference: C1206; Publisher: Altium Limited; PackageDescription: Chip Capacitor

## Sheet Mako DSP QuadFlash and Boot R2.1.SchDoc
size A
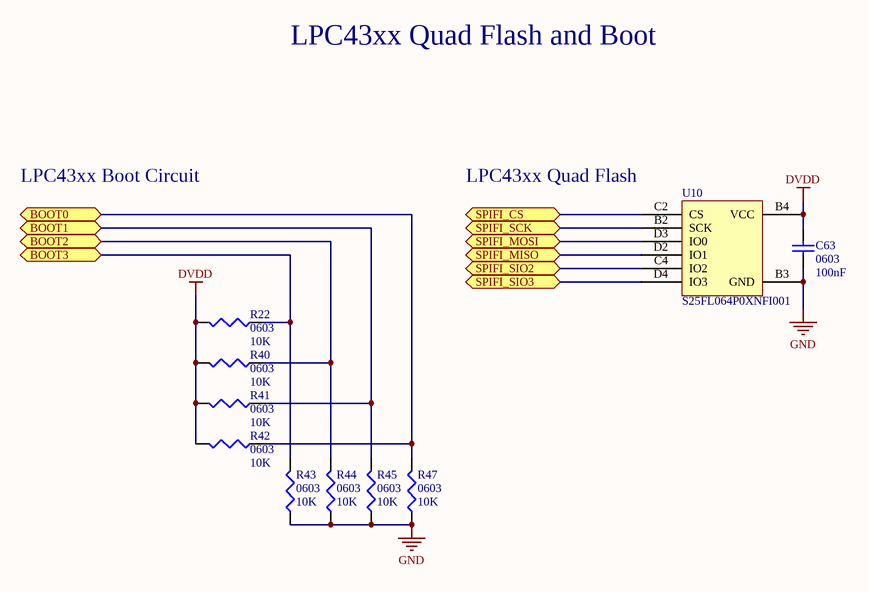
[diagram p7: Mako DSP QuadFlash and Boot R2.1.SchDoc]

### Parts
C63  0603  value 100nF  [1608[0603]]
R22  0603  value 10K  [J1-0603]
R40  0603  value 10K  [J1-0603]
R41  0603  value 10K  [J1-0603]
R42  0603  value 10K  [J1-0603]
R43  0603  value 10K  [J1-0603]
R44  0603  value 10K  [J1-0603]
R45  0603  value 10K  [J1-0603]
R47  0603  value 10K  [J1-0603]
U10  S25FL064P0XNFI001  [S25FL064P0XNFI001]

### Ports
BOOT0, BOOT1, BOOT2, BOOT3, SPIFI_CS, SPIFI_MISO, SPIFI_MOSI, SPIFI_SCK, SPIFI_SIO2, SPIFI_SIO3

### Nets
DVDD: C63.2 R22.2 R40.2 R41.2 R42.2 U10.B4(VCC)
GND: C63.1 R43.1 R44.1 R45.1 R47.1 U10.B3(GND)
NetR22_1: R22.1 R43.2 ; port BOOT3
NetR40_1: R40.1 R44.2 ; port BOOT2
NetR41_1: R41.1 R45.2 ; port BOOT1
NetR42_1: R42.1 R47.2 ; port BOOT0
NetU5_A15: U10.D4(IO3) ; port SPIFI_SIO3
NetU5_B13: U10.D2(IO1) ; port SPIFI_MISO
NetU5_B14: U10.B2(SCK) ; port SPIFI_SCK
NetU5_C10: U10.C2(CS) ; port SPIFI_CS
NetU5_C11: U10.D3(IO0) ; port SPIFI_MOSI
NetU5_C12: U10.C4(IO2) ; port SPIFI_SIO2

Not connected (* = marked no-connect by the designer): U10 A2(NC) A3(NC) A4(NC) A5(NC) B1(NC) B5(NC) C1(NC) C5(NC) D1(NC) D5(NC) E1(NC) E2(NC) E3(NC) E4(NC) E5(NC)

### Notes on the sheet
- LPC43xx Quad Flash and Boot
- LPC43xx Boot Circuit
- (near U10) LPC43xx Quad Flash

### Library data of the parts
C63 = Cap Semi: Capacitor (Semiconductor SIM Model); Published: 8-Jun-2000; LatestRevisionDate: 29-May-2009; LatestRevisionNote: IPC-7351 Footprint Added.; PackageReference: C1206; Publisher: Altium Limited; PackageDescription: Chip Capacitor
R22 R40-R45 R47 = Res3: Resistor; Published: 8-Jun-2000; LatestRevisionDate: 29-May-2009; LatestRevisionNote: IPC-7351 Footprint Added.; PackageReference: J1-0603; Publisher: Altium Limited; PackageDescription: Chip Resistor
U10 = S25FL064P0XNFI001: SPIFI Quad Flash

## Sheet Mako DSP SD Card and MIDI R2.1.SchDoc
size A
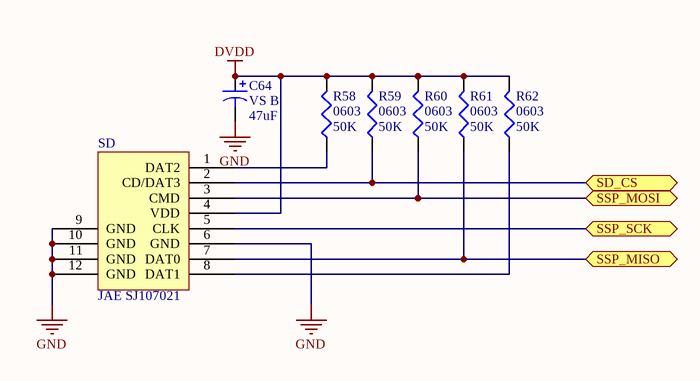
[diagram p8: Mako DSP SD Card and MIDI R2.1.SchDoc]

### Parts
C64  VS B  value 47uF  [Panasonic VS B]
R58  0603  value 50K  [J1-0603]
R59  0603  value 50K  [J1-0603]
R60  0603  value 50K  [J1-0603]
R61  0603  value 50K  [J1-0603]
R62  0603  value 50K  [J1-0603]
SD  JAE SJ107021  [JAE SJ107021]

### Ports
SD_CS, SSP_MISO, SSP_MOSI, SSP_SCK

### Nets
DVDD: C64.1 R58.2 R59.2 R60.2 R61.2 R62.2 SD.4(VDD)
GND: C64.2 SD.6(GND) SD.9(GND) SD.10(GND) SD.11(GND) SD.12(GND)
SSP_MISO: R61.1 SD.7(DAT0) ; port SSP_MISO
SSP_MOSI: R60.1 SD.3(CMD) ; port SSP_MOSI
SSP_SCK: SD.5(CLK) ; port SSP_SCK
NetR58_1: R58.1 SD.1(DAT2)
NetR59_1: R59.1 SD.2(CD/DAT3) ; port SD_CS
NetR62_1: R62.1 SD.8(DAT1)

### Library data of the parts
C64 = Cap Pol1: Polarized Capacitor (Radial); Published: 8-Jun-2000; LatestRevisionDate: 17-Jul-2002; LatestRevisionNote: Re-released for DXP Platform.; PackageReference: RB7.6-15; Publisher: Altium Limited; PackageDescription: Polarized Capacitor (Radial); 2 Leads
R58-R62 = Res3: Resistor; Published: 8-Jun-2000; LatestRevisionDate: 29-May-2009; LatestRevisionNote: IPC-7351 Footprint Added.; PackageReference: J1-0603; Publisher: Altium Limited; PackageDescription: Chip Resistor
SD = JAE SJ107021 microSD Card Socket